# EAGLE design permacam (EAGLE 9.5.1)
AUTHOR: NEAL JACKSON; REV: A; TITLE: PERMAMOTE

## Sheet 1 of 4
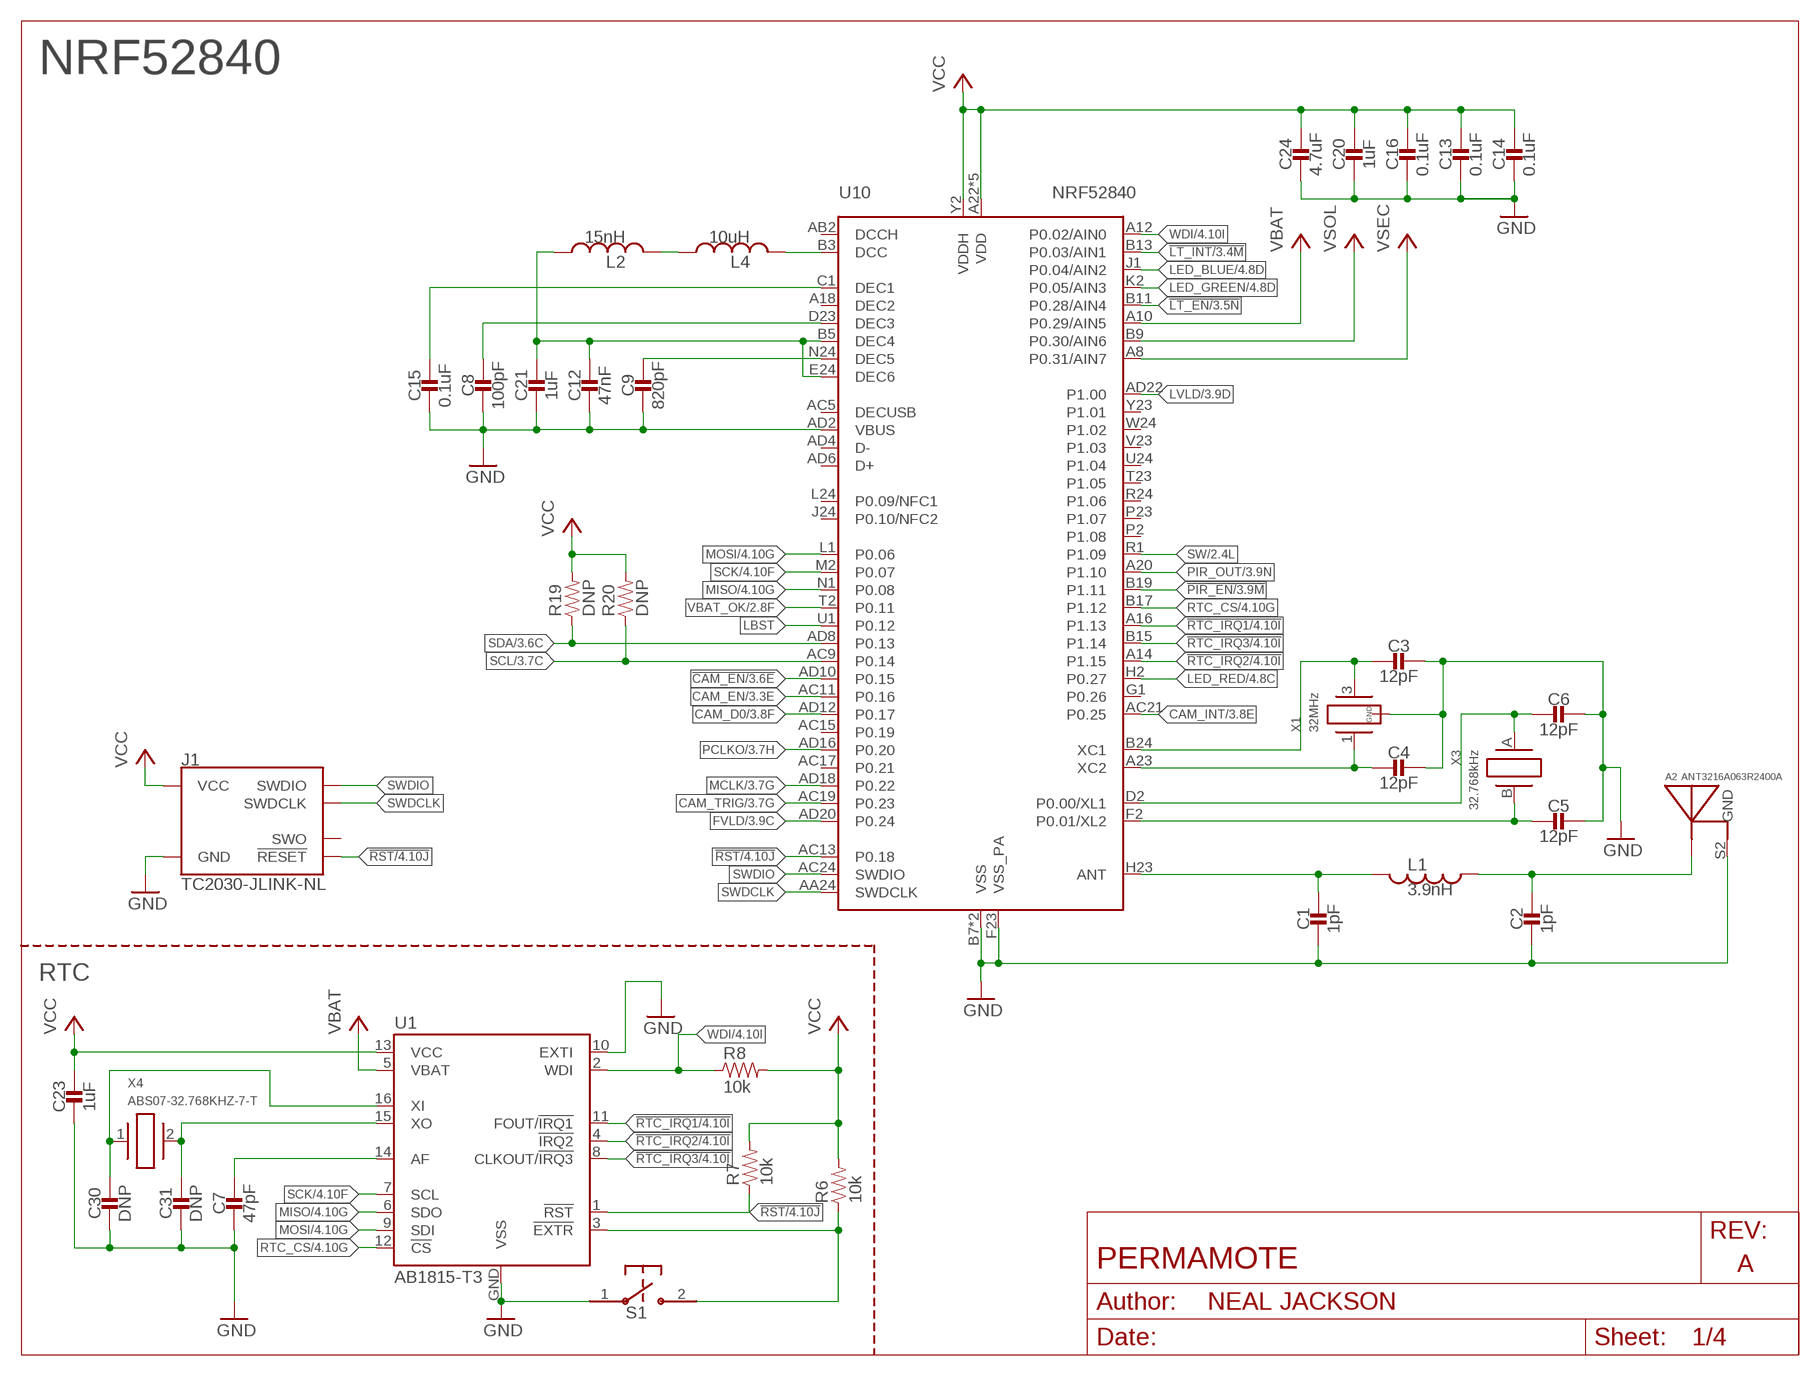
[diagram p0: schematic, sheet 1]

### Parts
A2  ANT3216A063R2400A  [ANT3216A063R2400A]
C1  1pF  CAPACITOR0402_CAP  [0402_CAP]
C2  1pF  CAPACITOR0402_CAP  [0402_CAP]
C3  12pF  CAPACITOR0402_CAP  [0402_CAP]
C4  12pF  CAPACITOR0402_CAP  [0402_CAP]
C5  12pF  CAPACITOR0402_CAP  [0402_CAP]
C6  12pF  CAPACITOR0402_CAP  [0402_CAP]
C7  47pF  CAPACITOR0402_CAP  [0402_CAP]
C8  100pF  CAPACITOR0402_CAP  [0402_CAP]
C9  820pF  CAPACITOR0402_CAP  [0402_CAP]
C12  47nF  CAPACITOR0402_CAP  [0402_CAP]
C13  0.1uF  CAPACITOR0402_CAP  [0402_CAP]
C14  0.1uF  CAPACITOR0402_CAP  [0402_CAP]
C15  0.1uF  CAPACITOR0402_CAP  [0402_CAP]
C16  0.1uF  CAPACITOR0402_CAP  [0402_CAP]
C20  1uF  CAPACITOR0402_CAP  [0402_CAP]
C21  1uF  CAPACITOR0402_CAP  [0402_CAP]
C23  1uF  CAPACITOR0402_CAP  [0402_CAP]
C24  4.7uF  CAPACITOR0402_CAP  [0402_CAP]
C30  DNP  CAPACITOR0402_CAP  [0402_CAP]
C31  DNP  CAPACITOR0402_CAP  [0402_CAP]
J1  TC2030-JLINK-NL  [TC2030-IDC-NL]
L1  3.9nH  INDUCTOR0402  [0402_CAP]
L2  15nH  INDUCTOR0402  [0402_CAP]
L4  10uH  INDUCTOR0603  [0603_CAP]
R6  10k  RESISTOR0402_RES  [0402_RES]
R7  10k  RESISTOR0402_RES  [0402_RES]
R8  10k  RESISTOR0402_RES  [0402_RES]
R19  DNP  RESISTOR0402_RES  [0402_RES]
R20  DNP  RESISTOR0402_RES  [0402_RES]
S1  B3U-1000P  [B3U-1000P]
U1  AB1815-T3  [QFN-16-3MM]
U10  NRF52840  [AQFN73]
X1  32MHz  7V-32.000MAHV-T  [TXC-7V]
X3  32.768kHz  ABS05-32.768KHZ-9-T  [ABS05]
X4  ABS07-32.768KHZ-7-T  [2-SMD]

### Nets
!CAM_EN: U10.AD10(P0.15) ; also sheet 3
!LT_EN: U10.B11(P0.28/AIN4) ; also sheet 3,4
!LT_INT: U10.B13(P0.03/AIN1) ; also sheet 3,4
!PIR_EN: U10.B19(P1.11) ; also sheet 3,4
!RST: J1.3(!RESET) R7.1 U1.1(!RST) U10.AC13(P0.18) ; also sheet 4
!RTC_EXTR: R6.1 S1.2 U1.3(!EXTR)
!RTC_IRQ1: U1.11(FOUT/!IRQ1) U10.A16(P1.13) ; also sheet 4
!RTC_IRQ2: U1.4(!IRQ2) U10.A14(P1.15) ; also sheet 4
!RTC_IRQ3: U1.8(CLKOUT/!IRQ3) U10.B15(P1.14) ; also sheet 4
CAM_D0: U10.AD12(P0.17) ; also sheet 3,4
CAM_EN: U10.AC11(P0.16) ; also sheet 3
CAM_INT: U10.AC21(P0.25) ; also sheet 3
CAM_TRIG: U10.AC19(P0.23) ; also sheet 3
FVLD: U10.AD20(P0.24) ; also sheet 3,4
GND: A2.S2(GND) C1.2 C2.2 C3.1 C4.1 C5.1 C6.1 C7.2 C8.2 C9.2 C12.2 C13.2 C14.2 C15.2 C16.2 C20.2 C21.2 C23.2 C24.2 C30.2 C31.2 J1.5(GND) S1.1 U1.10(EXTI) U1.GND(VSS) U10.AD2(VBUS) U10.B7(VSS) U10.F23(VSS_PA) U10.GND(VSS) X1.2(GND) X1.4(GND) ; also sheet 2,3,4
LBST: U10.U1(P0.12) ; also sheet 2
LED_BLUE: U10.J1(P0.04/AIN2) ; also sheet 4
LED_GREEN: U10.K2(P0.05/AIN3) ; also sheet 4
LED_RED: U10.H2(P0.27) ; also sheet 4
LVLD: U10.AD22(P1.00) ; also sheet 3,4
MCLK: U10.AD18(P0.22) ; also sheet 3,4
MISO: U1.6(SDO) U10.N1(P0.08) ; also sheet 4
MOSI: U1.9(SDI) U10.L1(P0.06) ; also sheet 4
N$1: C9.1 U10.N24(DEC5)
N$2: C15.1 U10.C1(DEC1)
N$3: C12.1 C21.1 L2.1 U10.B5(DEC4) U10.E24(DEC6)
N$4: C8.1 U10.D23(DEC3)
N$5: C1.1 L1.2 U10.H23(ANT)
N$6: A2.S1(ANTENNA) C2.1 L1.1
N$8: C3.2 U10.B24(XC1) X1.3
N$9: C4.2 U10.A23(XC2) X1.1
N$25: C7.1 U1.14(AF)
N$26: C30.1 U1.16(XI) X4.1
N$27: C31.1 U1.15(XO) X4.2
N$44: L4.2 U10.B3(DCC)
N$49: L2.2 L4.1
PCLKO: U10.AD16(P0.20) ; also sheet 3,4
PIR_OUT: U10.A20(P1.10) ; also sheet 3,4
RTC_CS: U1.12(!CS) U10.B17(P1.12) ; also sheet 4
SCK: U1.7(SCL) U10.M2(P0.07) ; also sheet 4
SCL: R20.1 U10.AC9(P0.14) ; also sheet 3,4
SDA: R19.1 U10.AD8(P0.13) ; also sheet 3,4
SW: U10.R1(P1.09) ; also sheet 2,4
SWDCLK: J1.4(SWDCLK) U10.AA24(SWDCLK)
SWDIO: J1.2(SWDIO) U10.AC24(SWDIO)
VBAT: U1.5(VBAT) U10.A10(P0.29/AIN5) ; also sheet 2
VBAT_OK: U10.T2(P0.11) ; also sheet 2
VCC: C13.1 C14.1 C16.1 C20.1 C23.1 C24.1 J1.1(VCC) R6.2 R7.2 R8.2 R19.2 R20.2 U1.13(VCC) U10.A22(VDD) U10.AD14(VDD) U10.AD23(VDD) U10.B1(VDD) U10.W1(VDD) U10.Y2(VDDH) ; also sheet 2,3,4
VSEC: U10.A8(P0.31/AIN7) ; also sheet 2
VSOL: U10.B9(P0.30/AIN6) ; also sheet 2,4
WDI: R8.1 U1.2(WDI) U10.A12(P0.02/AIN0) ; also sheet 4
XL1: C6.2 U10.D2(P0.00/XL1) X3.A
XL2: C5.2 U10.F2(P0.01/XL2) X3.B
Unconnected: J1.6(SWO) U10.A18(DEC2) U10.AB2(DCCH) U10.AC5(DECUSB) U10.AC15(P0.19) U10.AC17(P0.21) U10.AD4(D-) U10.AD6(D+) U10.G1(P0.26) U10.J24(P0.10/NFC2) U10.L24(P0.09/NFC1) U10.P2(P1.08) U10.P23(P1.07) U10.R24(P1.06) U10.T23(P1.05) U10.U24(P1.04) U10.V23(P1.03) U10.W24(P1.02) U10.Y23(P1.01)

### Notes on the sheet
- NRF52840
- RTC

## Sheet 2 of 4
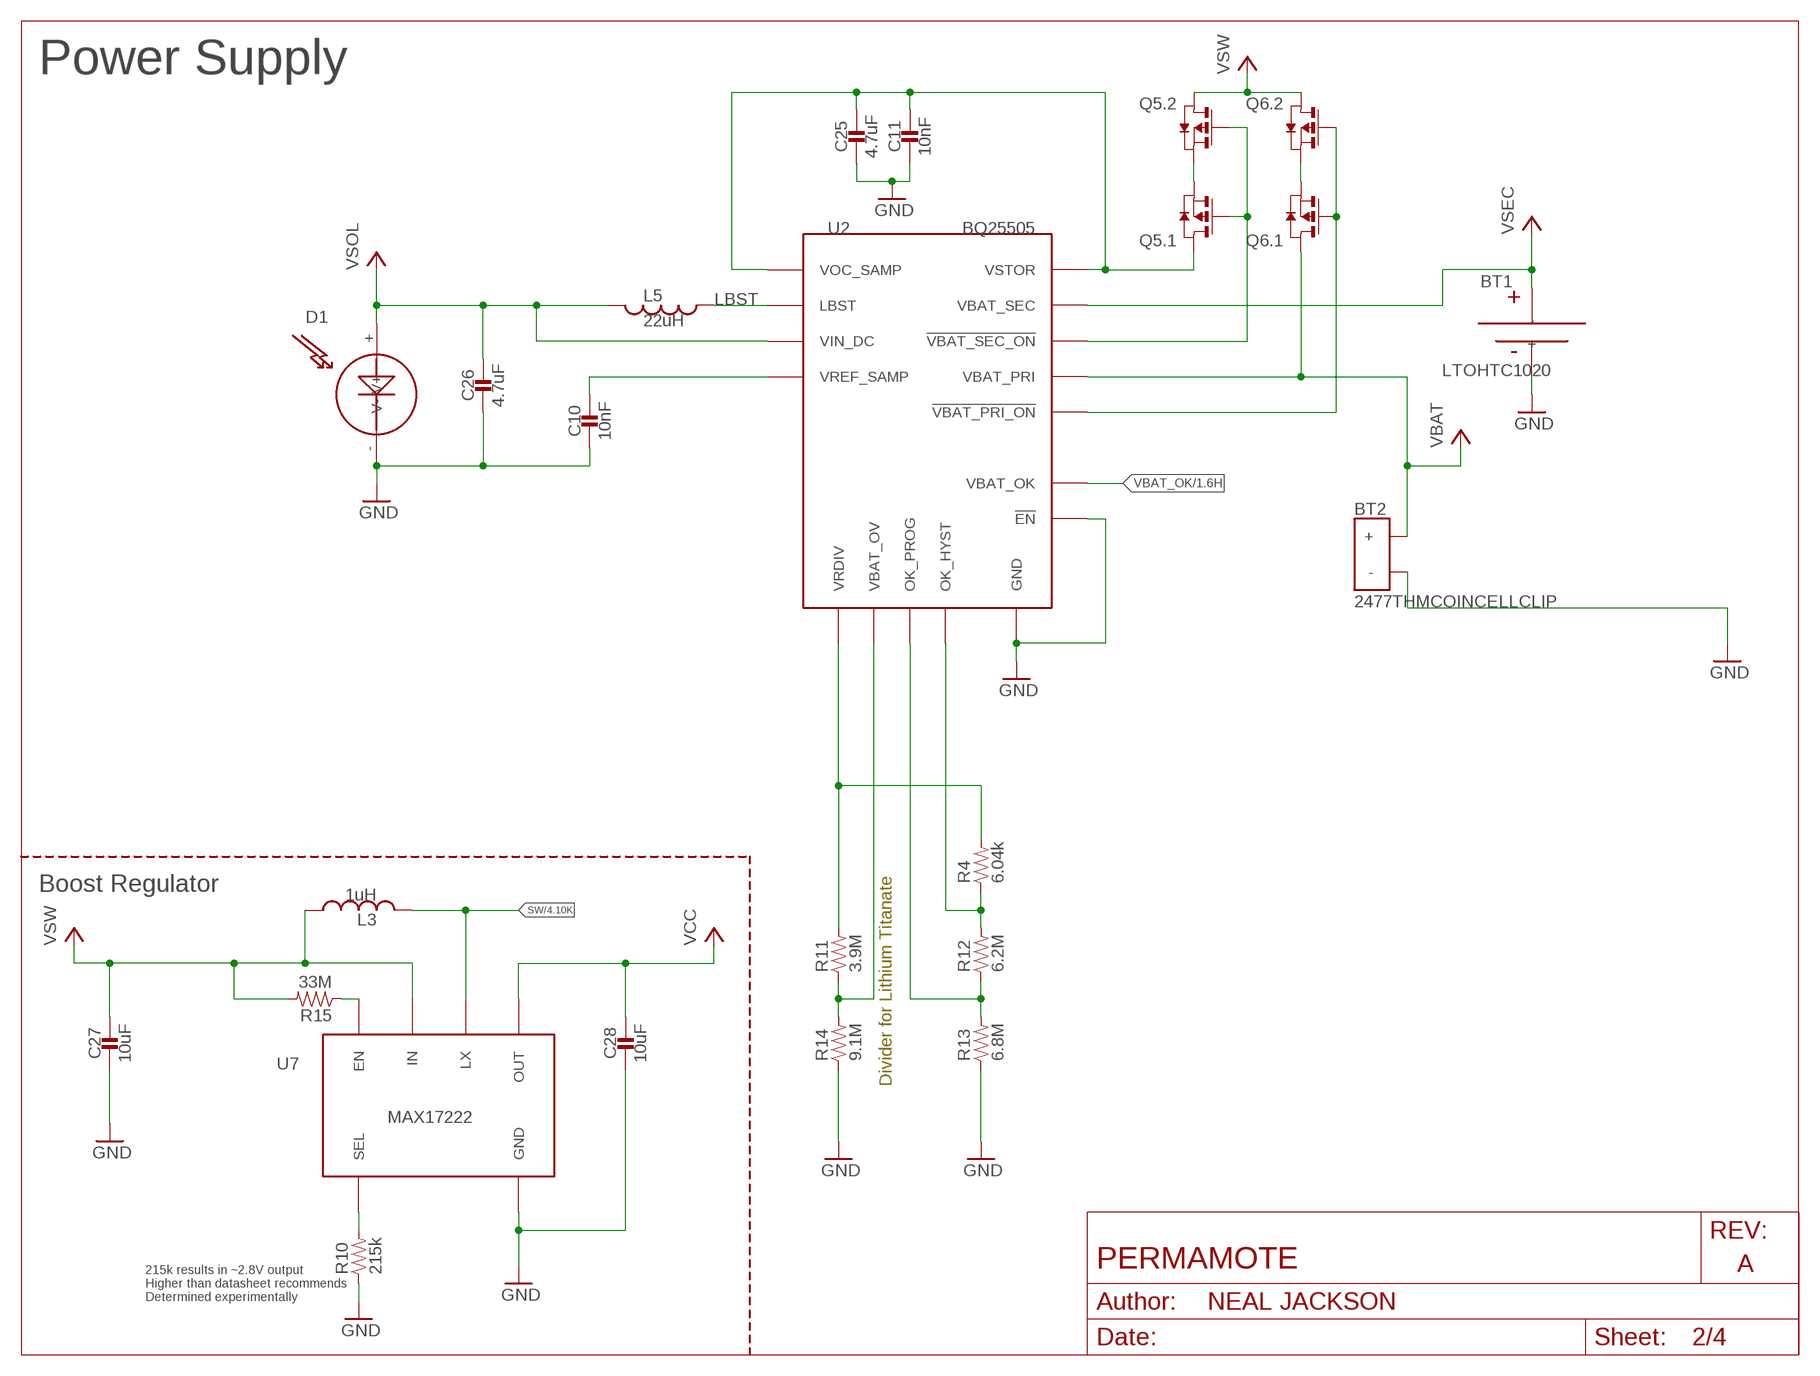
[diagram p1: schematic, sheet 2]

### Parts
BT1  LTOHTC1020  [1020]
BT2  2477THMCOINCELLCLIP  [2477THMCOINCLIP]
C10  10nF  CAPACITOR0402_CAP  [0402_CAP]
C11  10nF  CAPACITOR0402_CAP  [0402_CAP]
C25  4.7uF  CAPACITOR0402_CAP  [0402_CAP]
C26  4.7uF  CAPACITOR0402_CAP  [0402_CAP]
C27  10uF  CAPACITOR0603_CAP  [0603_CAP]
C28  10uF  CAPACITOR0603_CAP  [0603_CAP]
D1  SOLARCELLHOLES  [SOLAR_HOLES]
L3  1uH  INDUCTORIHL  [IHL-1212BZ-11]
L5  22uH  INDUCTOR74437324220  [74437324220]
Q5  PMDXB950UPEL  [XDFN-6]
Q6  PMDXB950UPEL  [XDFN-6]
R4  6.04k  RESISTOR0402_RES  [0402_RES]
R10  215k  RESISTOR0603_RES  [0603-RES]
R11  3.9M  RESISTOR0402_RES  [0402_RES]
R12  6.2M  RESISTOR0402_RES  [0402_RES]
R13  6.8M  RESISTOR0402_RES  [0402_RES]
R14  9.1M  RESISTOR0402_RES  [0402_RES]
R15  33M  RESISTOR0603_RES  [0603-RES]
U2  BQ25505  [S-PVQFN-N20-RGR]
U7  MAX17222  [UDFN-6-MAXIM]

### Nets
!VBAT_PRI_ON: Q6.2(.1:G) Q6.5(.2:G) U2.10(!VBAT_PRI_ON)
!VBAT_SEC_ON: Q5.2(.1:G) Q5.5(.2:G) U2.9(!VBAT_SEC_ON)
GND: BT1.- BT2.GND(-) C10.2 C11.2 C25.2 C26.2 C27.2 C28.2 D1.-(V-) R10.1 R13.1 R14.1 U2.1(GND) U2.5(!EN) U2.6(GND) U2.15(GND) U2.16(GND) U2.17(GND) U2.PAD(GND) U7.3(GND) ; also sheet 1,3,4
LBST: L5.P$1 U2.20(LBST) ; also sheet 1
N$12: R10.2 U7.4(SEL)
N$14: R15.1 U7.6(EN)
N$18: R11.1 R14.2 U2.7(VBAT_OV)
N$32: R4.2 R11.2 U2.8(VRDIV)
N$45: Q5.1(.1:S) Q5.4(.2:S)
N$53: Q6.1(.1:S) Q6.4(.2:S)
N$57: R12.1 R13.2 U2.12(OK_PROG)
N$58: R4.1 R12.2 U2.11(OK_HYST)
SW: L3.P$2 U7.2(LX) ; also sheet 1,4
VBAT: BT2.1(+) BT2.2(+) Q6.6(.1:D) U2.14(VBAT_PRI) ; also sheet 1
VBAT_OK: U2.13(VBAT_OK) ; also sheet 1
VCC: C28.1 U7.1(OUT) ; also sheet 1,3,4
VOC_SAMP_VSTOR: C11.1 C25.1 Q5.6(.1:D) U2.3(VOC_SAMP) U2.19(VSTOR)
VREF_SAMP: C10.1 U2.4(VREF_SAMP)
VSEC: BT1.+ U2.18(VBAT_SEC) ; also sheet 1
VSOL: C26.1 D1.+(V+) L5.P$2 U2.2(VIN_DC) ; also sheet 1,4
VSW: C27.1 L3.P$1 Q5.3(.2:D) Q6.3(.2:D) R15.2 U7.5(IN)

### Notes on the sheet
- Power Supply
- Boost Regulator
- Divider for Lithium Titanate
- 215k results in ~2.8V output
  Higher than datasheet recommends
  Determined experimentally

## Sheet 3 of 4
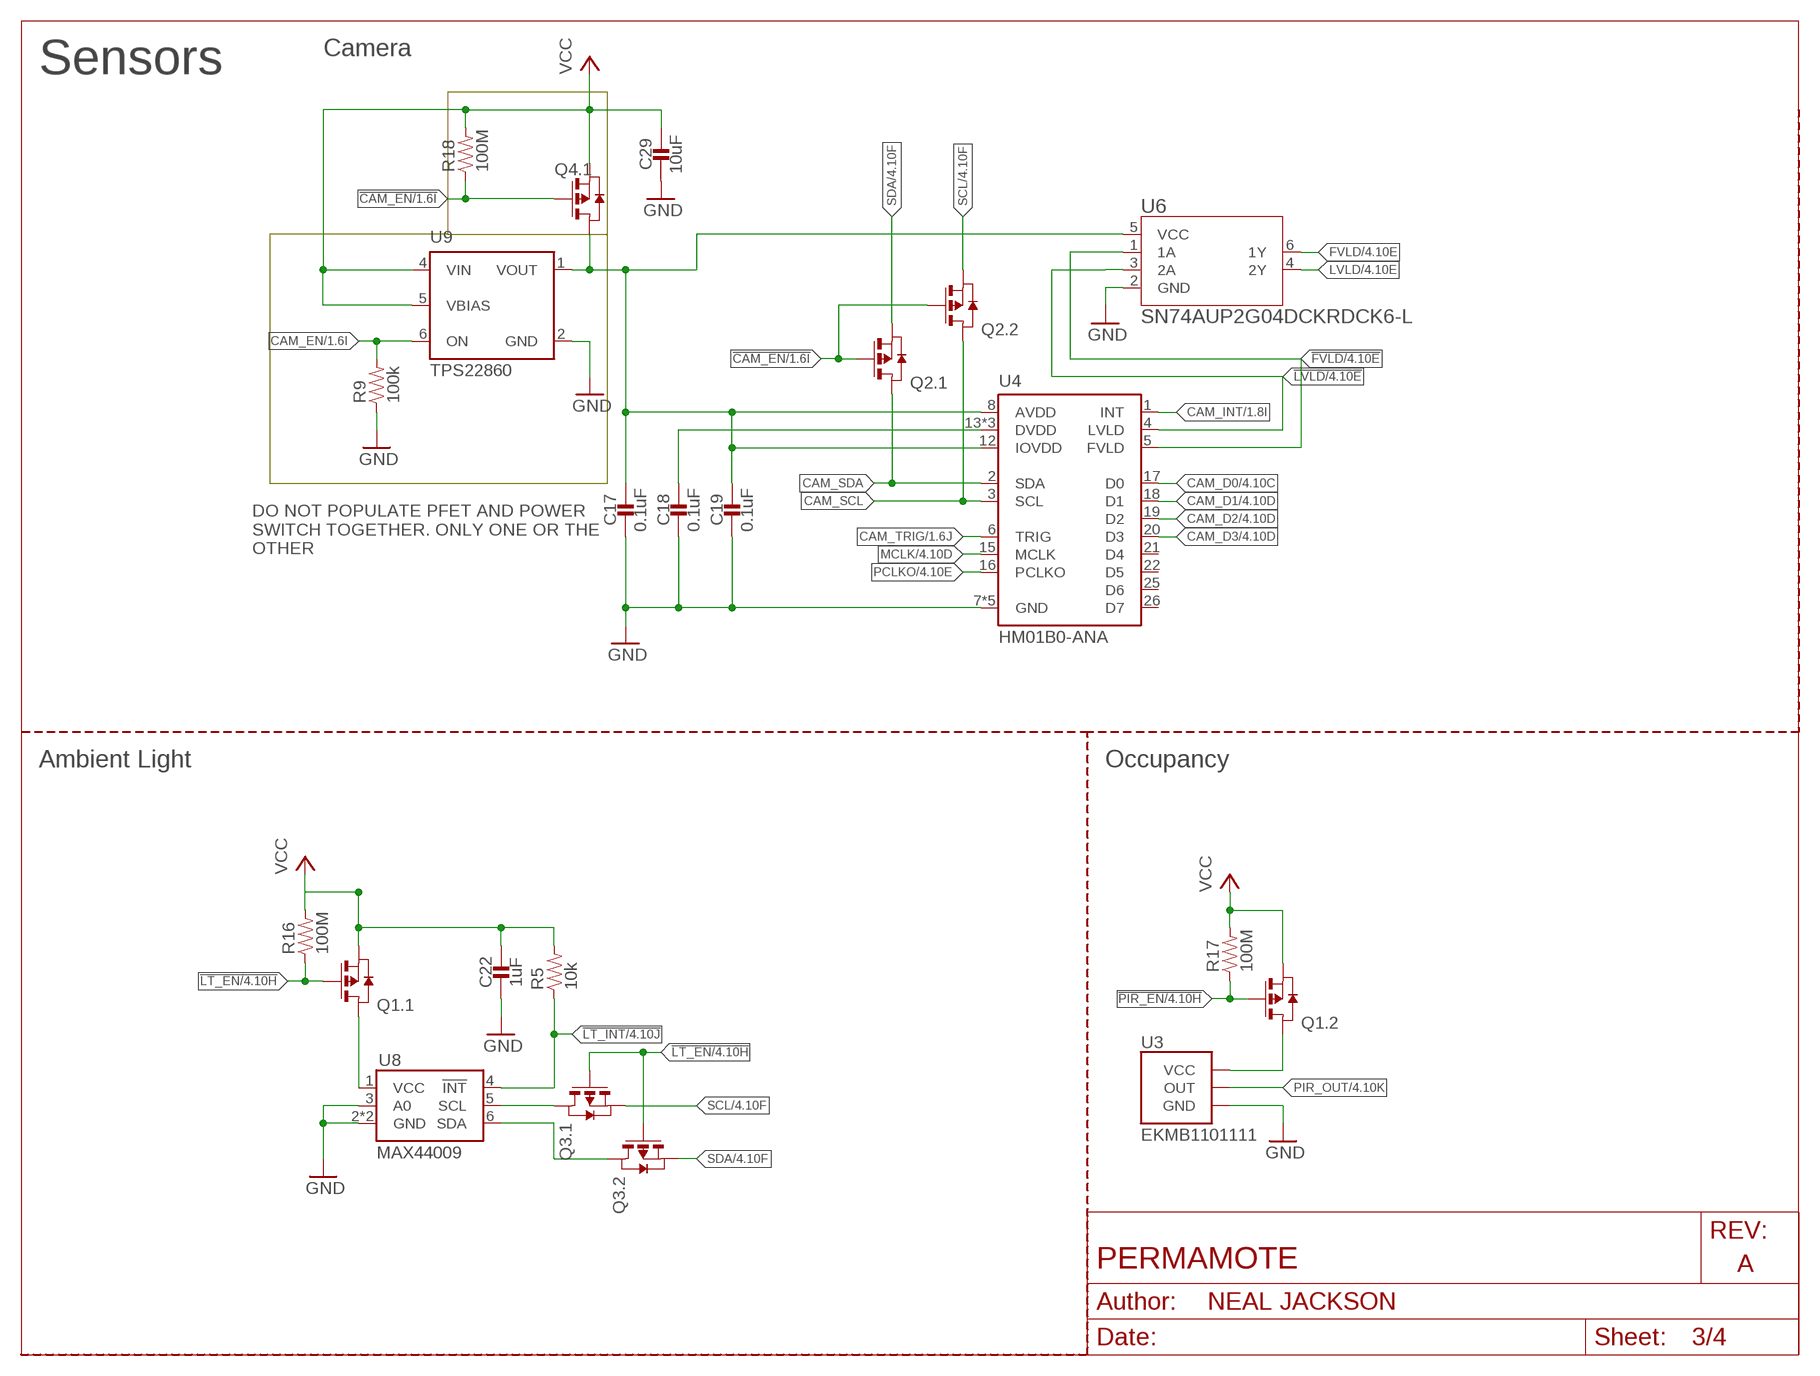
[diagram p2: schematic, sheet 3]

### Parts
C17  0.1uF  CAPACITOR0402_CAP  [0402_CAP]
C18  0.1uF  CAPACITOR0402_CAP  [0402_CAP]
C19  0.1uF  CAPACITOR0402_CAP  [0402_CAP]
C22  1uF  CAPACITOR0402_CAP  [0402_CAP]
C29  10uF  CAPACITOR0603_CAP  [0603_CAP]
Q1  PMDXB950UPEL  [XDFN-6]
Q2  PMDXB950UPEL  [XDFN-6]
Q3  PMDXB950UPEL  [XDFN-6]
Q4  PMDXB950UPEL  [XDFN-6]
R5  10k  RESISTOR0402_RES  [0402_RES]
R9  100k  RESISTOR0402_RES  [0402_RES]
R16  100M  RESISTOR0402_RES  [0402_RES]
R17  100M  RESISTOR0402_RES  [0402_RES]
R18  100M  RESISTOR0402_RES  [0402_RES]
U3  EKMB1101111  [AMN2]
U4  HM01B0-ANA  [NEOPAC-26]
U6  SN74AUP2G04DCKRDCK6-L  [DCK6-L]
U8  MAX44009  [UDFN-6-EXPOSED]
U9  TPS22860  [SOT-23-6]

### Nets
!CAM_EN: Q2.2(.1:G) Q2.5(.2:G) Q4.2(.1:G) R18.1 ; also sheet 1
!FVLD: U4.5(FVLD) U6.1(1A) ; also sheet 4
!LT_EN: Q1.2(.1:G) Q3.2(.1:G) Q3.5(.2:G) R16.1 ; also sheet 1,4
!LT_INT: R5.1 U8.4(!INT) ; also sheet 1,4
!LVLD: U4.4(LVLD) U6.3(2A) ; also sheet 4
!PIR_EN: Q1.5(.2:G) R17.1 ; also sheet 1,4
CAM_D0: U4.17(D0) ; also sheet 1,4
CAM_D1: U4.18(D1) ; also sheet 4
CAM_D2: U4.19(D2) ; also sheet 4
CAM_D3: U4.20(D3) ; also sheet 4
CAM_EN: R9.2 U9.6(ON) ; also sheet 1
CAM_INT: U4.1(INT) ; also sheet 1
CAM_SCL: Q2.3(.2:D) U4.3(SCL)
CAM_SDA: Q2.6(.1:D) U4.2(SDA)
CAM_TRIG: U4.6(TRIG) ; also sheet 1
FVLD: U6.6(1Y) ; also sheet 1,4
GND: C17.2 C18.2 C19.2 C22.2 C29.2 R9.1 U3.GND U4.7(GND) U4.9(GND) U4.10(GND) U4.11(GND) U4.24(GND) U6.2(GND) U8.2(GND) U8.3(A0) U8.EP(GND) U9.2(GND) ; also sheet 1,2,4
LVLD: U6.4(2Y) ; also sheet 1,4
MCLK: U4.15(MCLK) ; also sheet 1,4
N$10: C18.1 U4.13(DVDD) U4.14(DVDD) U4.23(DVDD)
N$13: C17.1 C19.1 Q4.6(.1:D) U4.8(AVDD) U4.12(IOVDD) U6.5(VCC) U9.1(VOUT)
N$20: Q1.6(.1:D) U8.1(VCC)
N$23: Q1.3(.2:D) U3.VCC
N$51: Q3.3(.2:D) U8.6(SDA)
N$52: Q3.6(.1:D) U8.5(SCL)
PCLKO: U4.16(PCLKO) ; also sheet 1,4
PIR_OUT: U3.OUT ; also sheet 1,4
SCL: Q2.4(.2:S) Q3.1(.1:S) ; also sheet 1,4
SDA: Q2.1(.1:S) Q3.4(.2:S) ; also sheet 1,4
VCC: C22.1 C29.1 Q1.1(.1:S) Q1.4(.2:S) Q4.1(.1:S) R5.2 R16.2 R17.2 R18.2 U9.4(VIN) U9.5(VBIAS) ; also sheet 1,2,4
Unconnected: Q4.3(.2:D) Q4.4(.2:S) Q4.5(.2:G) U4.21(D4) U4.22(D5) U4.25(D6) U4.26(D7)

### Notes on the sheet
- Camera
- Sensors
- DO NOT POPULATE PFET AND POWER
  SWITCH TOGETHER. ONLY ONE OR THE
  OTHER
- Ambient Light | Occupancy

## Sheet 4 of 4
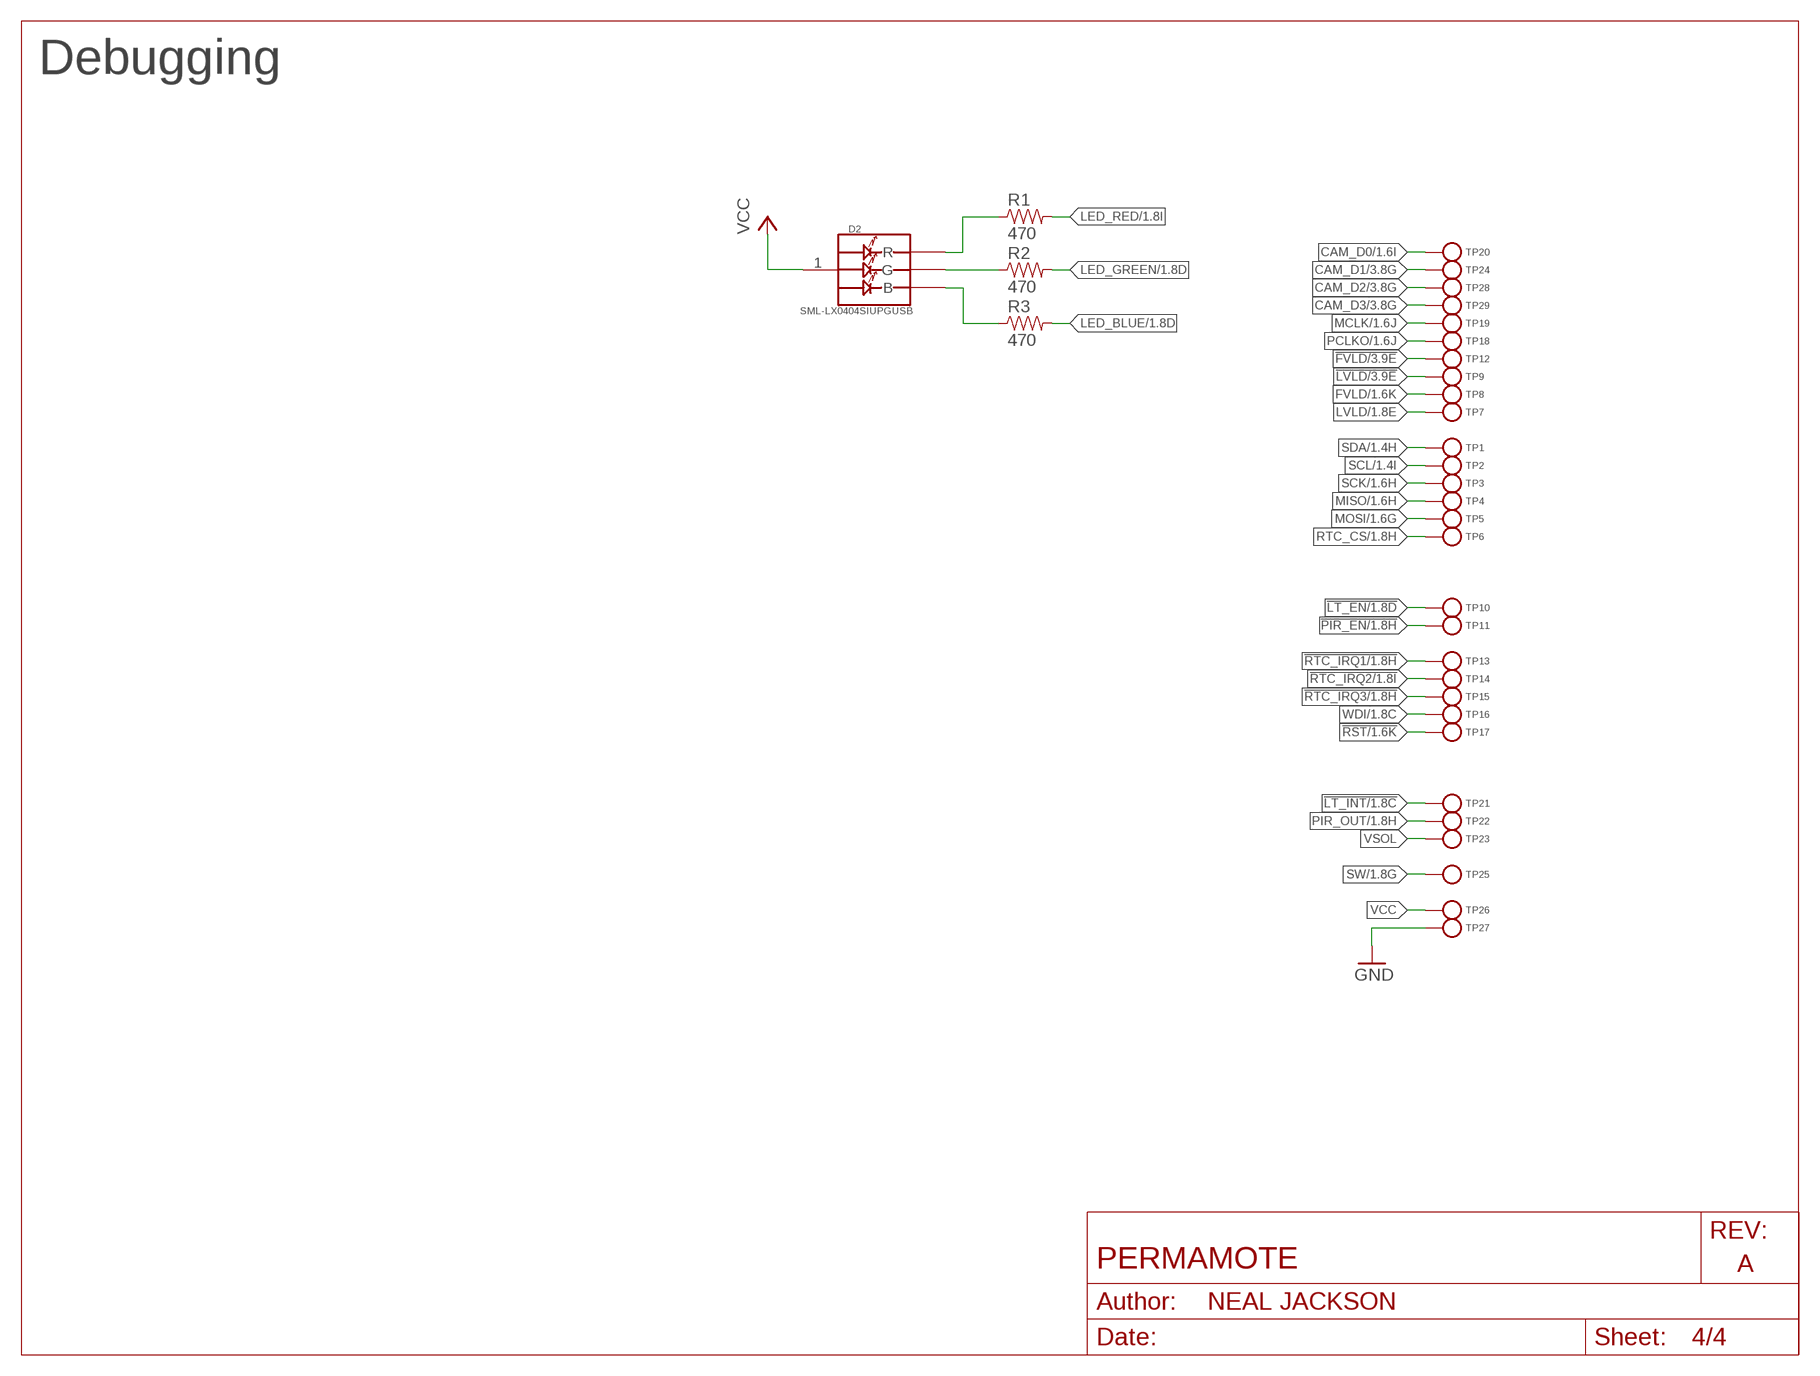
[diagram p3: schematic, sheet 4]

### Parts
D2  SML-LX0404SIUPGUSB  [1MM_SQ_4PAD]
R1  470  RESISTOR0402_RES  [0402_RES]
R2  470  RESISTOR0402_RES  [0402_RES]
R3  470  RESISTOR0402_RES  [0402_RES]
TP1  TEST-POINT  [PAD.03X.03]
TP2  TEST-POINT  [PAD.03X.03]
TP3  TEST-POINT  [PAD.03X.03]
TP4  TEST-POINT  [PAD.03X.03]
TP5  TEST-POINT  [PAD.03X.03]
TP6  TEST-POINT  [PAD.03X.03]
TP7  TEST-POINT  [PAD.03X.03]
TP8  TEST-POINT  [PAD.03X.03]
TP9  TEST-POINT  [PAD.03X.03]
TP10  TEST-POINT  [PAD.03X.03]
TP11  TEST-POINT  [PAD.03X.03]
TP12  TEST-POINT  [PAD.03X.03]
TP13  TEST-POINT  [PAD.03X.03]
TP14  TEST-POINT  [PAD.03X.03]
TP15  TEST-POINT  [PAD.03X.03]
TP16  TEST-POINT  [PAD.03X.03]
TP17  TEST-POINT  [PAD.03X.03]
TP18  TEST-POINT  [PAD.03X.03]
TP19  TEST-POINT  [PAD.03X.03]
TP20  TEST-POINT  [PAD.03X.03]
TP21  TEST-POINT  [PAD.03X.03]
TP22  TEST-POINT  [PAD.03X.03]
TP23  TEST-POINT  [PAD.03X.03]
TP24  TEST-POINT  [PAD.03X.03]
TP25  TEST-POINT  [PAD.03X.03]
TP26  TEST-POINT  [PAD.03X.03]
TP27  TEST-POINT  [PAD.03X.03]
TP28  TEST-POINT  [PAD.03X.03]
TP29  TEST-POINT  [PAD.03X.03]

### Nets
!FVLD: TP12.P$1(TESTPOINT) ; also sheet 3
!LT_EN: TP10.P$1(TESTPOINT) ; also sheet 1,3
!LT_INT: TP21.P$1(TESTPOINT) ; also sheet 1,3
!LVLD: TP9.P$1(TESTPOINT) ; also sheet 3
!PIR_EN: TP11.P$1(TESTPOINT) ; also sheet 1,3
!RST: TP17.P$1(TESTPOINT) ; also sheet 1
!RTC_IRQ1: TP13.P$1(TESTPOINT) ; also sheet 1
!RTC_IRQ2: TP14.P$1(TESTPOINT) ; also sheet 1
!RTC_IRQ3: TP15.P$1(TESTPOINT) ; also sheet 1
CAM_D0: TP20.P$1(TESTPOINT) ; also sheet 1,3
CAM_D1: TP24.P$1(TESTPOINT) ; also sheet 3
CAM_D2: TP28.P$1(TESTPOINT) ; also sheet 3
CAM_D3: TP29.P$1(TESTPOINT) ; also sheet 3
FVLD: TP8.P$1(TESTPOINT) ; also sheet 1,3
GND: TP27.P$1(TESTPOINT) ; also sheet 1,2,3
LED_BLUE: R3.2 ; also sheet 1
LED_GREEN: R2.2 ; also sheet 1
LED_RED: R1.2 ; also sheet 1
LVLD: TP7.P$1(TESTPOINT) ; also sheet 1,3
MCLK: TP19.P$1(TESTPOINT) ; also sheet 1,3
MISO: TP4.P$1(TESTPOINT) ; also sheet 1
MOSI: TP5.P$1(TESTPOINT) ; also sheet 1
N$15: D2.2(R) R1.1
N$17: D2.4(G) R2.1
N$19: D2.3(B) R3.1
PCLKO: TP18.P$1(TESTPOINT) ; also sheet 1,3
PIR_OUT: TP22.P$1(TESTPOINT) ; also sheet 1,3
RTC_CS: TP6.P$1(TESTPOINT) ; also sheet 1
SCK: TP3.P$1(TESTPOINT) ; also sheet 1
SCL: TP2.P$1(TESTPOINT) ; also sheet 1,3
SDA: TP1.P$1(TESTPOINT) ; also sheet 1,3
SW: TP25.P$1(TESTPOINT) ; also sheet 1,2
VCC: D2.1(VDD) TP26.P$1(TESTPOINT) ; also sheet 1,2,3
VSOL: TP23.P$1(TESTPOINT) ; also sheet 1,2
WDI: TP16.P$1(TESTPOINT) ; also sheet 1

### Notes on the sheet
- Debugging

## Library data of the parts
A2 = chips:ANT3216A063R2400A: Yageo 2.4GHz WiFi/Bluetooth/Zigbee/ISM Chip Antenna; DIGIKEY: 311-1542-1-ND; MANUFACTURER: YAGEO; MPN: ANT3216A063R2400A
BT1 = batteries:LTOHTC
BT2 = batteries:2477THMCOINCELLCLIP: Battery clip for 2477 Coin Cell; DIGIKEY: 36-3039-ND; MANUFACTURER: Keystone; MPN: 3039
C1 C2 = passives:CAPACITOR: SMD Capacitor; DIGIKEY: 1276-1595-1-ND; MPN: CL05C010CB5NNNC
C3-C6 = passives:CAPACITOR: SMD Capacitor; DIGIKEY: 490-6197-1-ND; MPN: GRM1555C1H120GA01D
C7 = passives:CAPACITOR: SMD Capacitor; DIGIKEY: 490-5942-1-ND; MPN: GRM1555C1H470JA01D
C8 = passives:CAPACITOR: SMD Capacitor; DIGIKEY: 490-5922-1-ND; MPN: GRM1555C1H101JA01D
C9 = passives:CAPACITOR: SMD Capacitor; DIGIKEY: 1276-6535-1-ND; MPN: CL05B821KO5NNNC
C10 C11 = passives:CAPACITOR: SMD Capacitor; DIGIKEY: 490-4516-1-ND; MPN: GRM155R71H103KA88D
C12 = passives:CAPACITOR: SMD Capacitor; DIGIKEY: 445-1264-1-ND; MPN: C1005X7R1C473K050BC
C13-C19 = passives:CAPACITOR: SMD Capacitor; DIGIKEY: 490-6328-1-ND; MPN: GRM155R71C104KA88J
C20-C23 = passives:CAPACITOR: SMD Capacitor; DIGIKEY: 490-7195-1-ND; MPN: GRM155R70G105KA12D
C24-C26 = passives:CAPACITOR: SMD Capacitor; DIGIKEY: 445-5947-1-ND; MPN: C1005X5R0J475K050BC
C27-C29 = passives:CAPACITOR: SMD Capacitor; DIGIKEY: 490-3896-1-ND; MPN: GRM188R60J106ME47D
C30 C31 = passives:CAPACITOR: SMD Capacitor
D1 = permamote:SOLARCELL: Generic solar cell; DIGIKEY: 869-1001-ND; MPN: AM-1454CA
D2 = leds:SML-LX0404SIUPGUSB: 1mm^2 RGB LED; DIGIKEY: 67-2125-1-ND; MANUFACTURER: Lumex Opto; MPN: SML-LX0404SIUPGUSB
J1 = connector:TC2030-JLINK
L1 = passives:INDUCTOR: A very specific inductor; DIGIKEY: 490-1131-1-ND; MPN: LQP15MN3N9B02D
L2 = passives:INDUCTOR: A very specific inductor; DIGIKEY: 587-1521-1-ND; MPN: HK100515NJ-T
L3 = passives:INDUCTOR: A very specific inductor; DIGIKEY: 541-1319-1-ND; MANUFACTURER: Vishay Dale; MPN: IHLP1212BZER1R0M11
L4 = passives:INDUCTOR: A very specific inductor; DIGIKEY: 490-4025-1-ND; MPN: LQM18FN100M00D
L5 = passives:INDUCTOR: A very specific inductor; DIGIKEY: 732-3340-1-ND; MPN: 74437324220
Q1-Q6 = fets:PMDXB950UPEL: 20 V 500mA, dual P-channel Trench MOSFET; DIGIKEY: 1727-2601-1-ND; MANUFACTURER: NEXPERIA; MPN: PMDXB950UPELZ
R1-R3 = passives:RESISTOR: Resistor Basic schematic elements and footprints for 0201, 0402, 0603, 1206, and PTH resistors.; DIGIKEY: 311-470JRCT-ND; MPN: RC0402JR-07470RL
R4 = passives:RESISTOR: Resistor Basic schematic elements and footprints for 0201, 0402, 0603, 1206, and PTH resistors.; DIGIKEY: YAG2293CT-ND; MPN: RC0402FR-076K04L
R5-R8 = passives:RESISTOR: Resistor Basic schematic elements and footprints for 0201, 0402, 0603, 1206, and PTH resistors.; DIGIKEY: 311-10KJRCT-ND; MPN: RC0402JR-0710KL
R9 = passives:RESISTOR: Resistor Basic schematic elements and footprints for 0201, 0402, 0603, 1206, and PTH resistors.; DIGIKEY: 311-100KJRCT-ND; MPN: RC0402JR-07100KL
R10 = passives:RESISTOR: Resistor Basic schematic elements and footprints for 0201, 0402, 0603, 1206, and PTH resistors.; DIGIKEY: 311-215KHRCT-ND; MPN: RC0603FR-07215KL
R11 = passives:RESISTOR: Resistor Basic schematic elements and footprints for 0201, 0402, 0603, 1206, and PTH resistors.; DIGIKEY: YAG3301CT-ND; MPN: RC0402JR-073M9L
R12 = passives:RESISTOR: Resistor Basic schematic elements and footprints for 0201, 0402, 0603, 1206, and PTH resistors.; DIGIKEY: YAG3309CT-ND; MPN: RC0402JR-076M2L
R13 = passives:RESISTOR: Resistor Basic schematic elements and footprints for 0201, 0402, 0603, 1206, and PTH resistors.; DIGIKEY: YAG3310CT-ND; MPN: RC0402JR-076M8L
R14 = passives:RESISTOR: Resistor Basic schematic elements and footprints for 0201, 0402, 0603, 1206, and PTH resistors.; DIGIKEY: YAG3322CT-ND; MPN: RC0402JR-079M1L
R15 = passives:RESISTOR: Resistor Basic schematic elements and footprints for 0201, 0402, 0603, 1206, and PTH resistors.; DIGIKEY: HMC0603JT33M0CT-ND; MPN: HMC0603JT33M0
R16-R18 = passives:RESISTOR: Resistor Basic schematic elements and footprints for 0201, 0402, 0603, 1206, and PTH resistors.; DIGIKEY: 541-100MAHCT-ND; MPN: HMC0402JT100M
R19 R20 = passives:RESISTOR: Resistor Basic schematic elements and footprints for 0201, 0402, 0603, 1206, and PTH resistors.
S1 = switches:B3U: Switch; DIGIKEY: SW1020CT-ND; MANUFACTURER: Omron; MPN: B3U-1000P
TP1-TP29 = headers:TEST-POINT
U1 = chips:AB1815-T3: Ultra-low current RTC. 55nA quiescent @ 3V. 1.5-3.6V input.; DIGIKEY: 535-11936-1-ND; MANUFACTURER: Abracon; MPN: AB1815-T3
U2 = chips:BQ25505: EH front end for switching between primary and secondary cells; DIGIKEY: 296-37078-1-ND; MANUFACTURER: TI; MPN: BQ25505RGRR
U3 = chips:EKMB: Passive infrared human detection sensor with built-in amp.; DIGIKEY: 255-3065-ND; MANUFACTURER: PANASONIC; MPN: EKMB1101111
U4 = chips:HM01B0: ultra low power CMOS Image Sensor 320 x 320; MPN: HMB01B0-ANA
U6 = chips:SN74AUP2G04DCKR; MANUFACTURER_PART_NUMBER: SN74AUP2G04DCKR; VENDOR: Texas Instruments
U7 = chips:MAX17222: Very high efficiency, very low power boost converter suitable for EH applications; DIGIKEY: MAX17222ELT+TCT-ND; MANUFACTURER: MAXIM INTEGRATED; MPN: MAX17222ELT+T
U8 = chips:MAX44009: low power ambient light sensor; DIGIKEY: MAX44009EDT+TCT-ND; MANUFACTURER: MAXIM; MPN: MAX44009EDT+T
U9 = chips:TPS22860: Ultra-Low Leakage Load Switch; DIGIKEY: 296-43982-1-ND; MPN: TPS22860DBVR
U10 = chips:NRF52840: ultra-low power 2.4 GHz wireless system on chip (SoC) integrating a multiprotocol 2.4 GHz transceiver, an ARM® Cortex®-M4F CPU.; DIGIKEY: 1490-1071-1-ND; MANUFACTURER: NORIDIC SEMICONDUCTOR; MPN: NRF52840
X1 = crystals:7V: TXC CRYSTAL SMD; DIGIKEY: 887-2568-1-ND; MANUFACTURER: TXC CORPORATION; MPN: 7M-32.000MAHV-T
X3 = crystals:ABS05-32.768KHZ: 32.768kHz Crystal; DIGIKEY: 535-11897-1-ND; MANUFACTURER: Abracon; MPN: ABS05-32.768KHZ-9-T
X4 = crystals:ABS07-32.768KHZ: 32.768kHz Crystal; DIGIKEY: 535-9543-1-ND; MANUFACTURER: ABRACON; MPN: ABS07-32.768KHZ-7-T

## Board
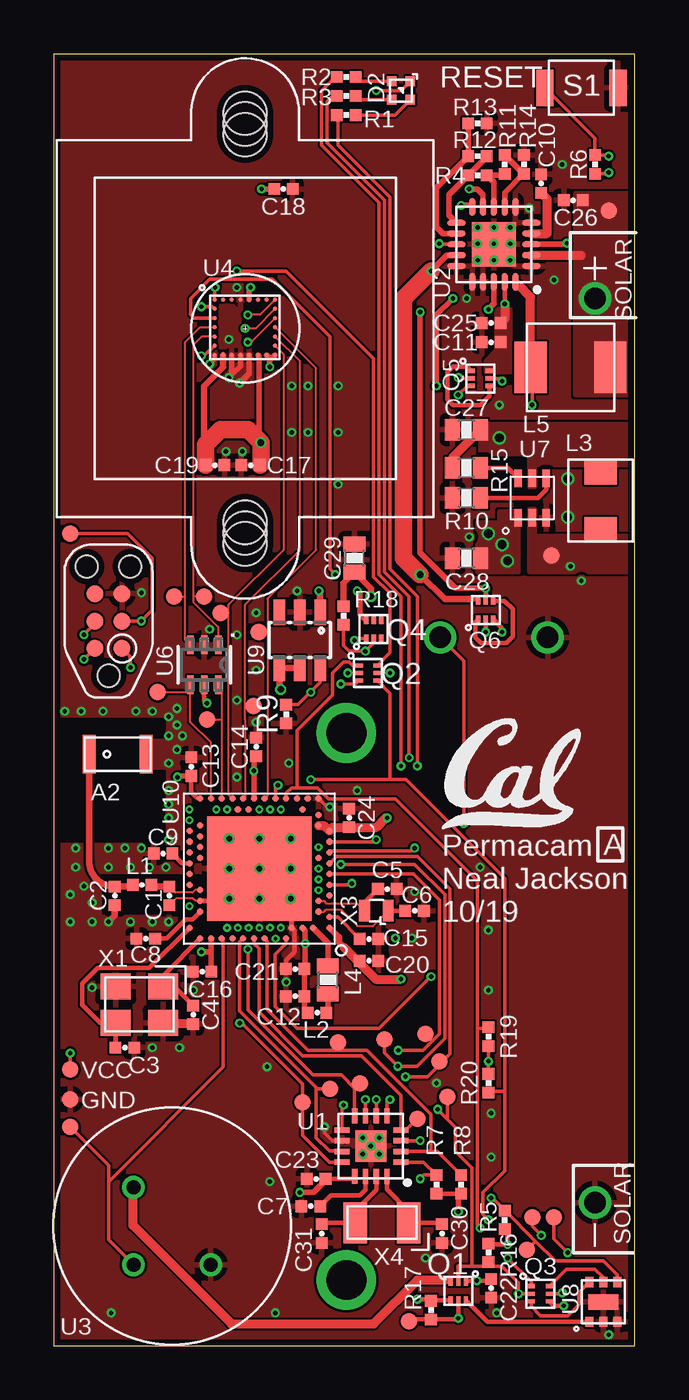
[diagram p4: board, top side]
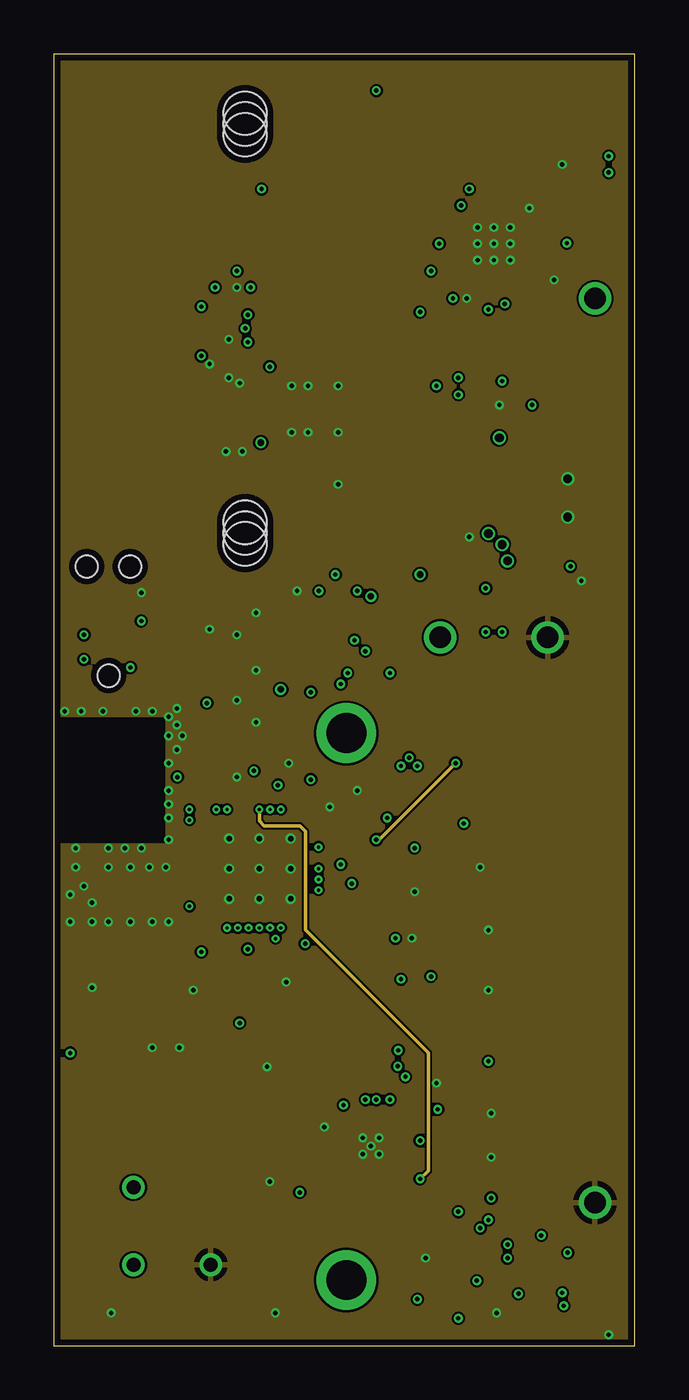
[diagram p5: board, inner layer Route2]
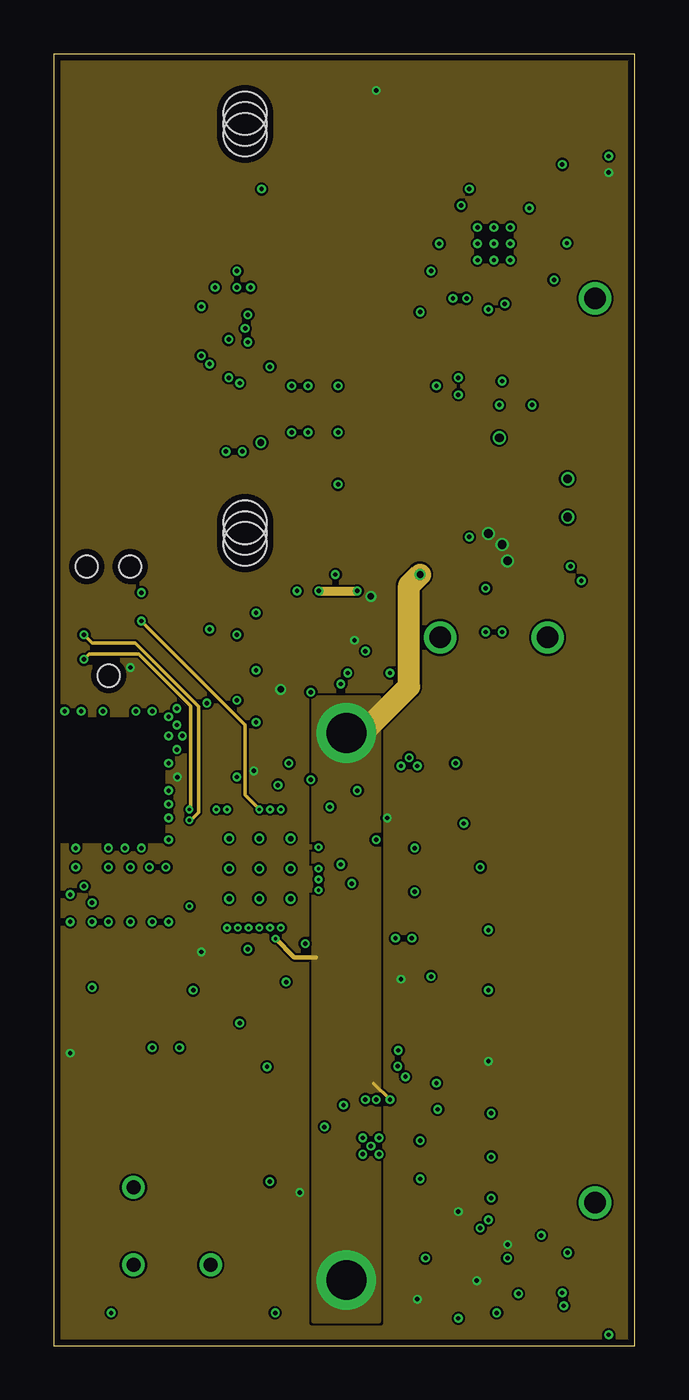
[diagram p6: board, inner layer Route15]
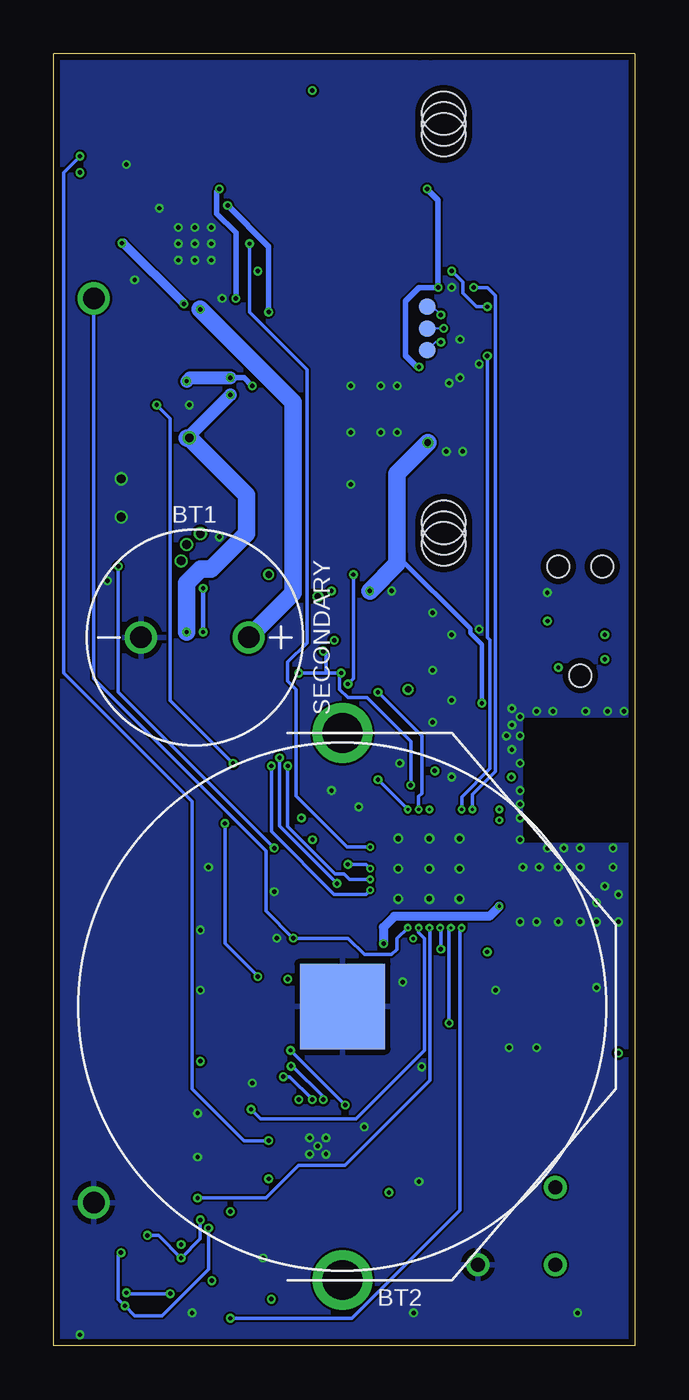
[diagram p7: board, bottom side, seen from below]

Size 27 x 60 mm. Coordinates in mm from the lower left corner, seen from the top.
Outline: 9.5,60 27,60 27,0 0,0 0,60 10,60
Copper layers (1+2*15+16): Top 0.0178mm / dielectric 59mil / Route2 0.0356mm / dielectric 0.1499mm / Route15 0.0356mm / dielectric 0.2007mm / Bottom 0.0178mm
Design rules "quickturn_co_kr_1oz_4lyr *": minimum track width 4mil, minimum drill 8mil, track to track 4mil, track to pad 4mil, pad to pad 4mil, via to via 4mil, smd to smd 4mil, copper to edge 12mil, drill to drill 12mil, minimum pad ring 8mil, minimum via ring 4mil, stop-mask expansion 3mil, vias tented up to drill 50mil, thermal gap 10mil
tRestrict: area 25.8,0.9 to 25.9,1.4

### Footprints (pad centres in the part's own frame; a part is rotated, then mirrored left to right if it is on the bottom)
ANT3216A063R2400A = smd 0.6 x 1.8: S1 -1.325,0; S2 1.325,0
1020 = drill 1: + -2.5,0; - 2.5,0
2477THMCOINCLIP = drill 1.854: 1 -12.7,0; 2 12.7,0 | smd 3.962 x 3.962: GND 0,0
0402_CAP = smd 0.536 x 0.546: 1 -0.433,0; 2 0.433,0
0603_CAP = smd 0.7 x 1: 1 -0.65,0; 2 0.65,0
SOLAR_HOLES = drill 1: + 0,0; - 42,0
1MM_SQ_4PAD = smd 0.457 x 0.457: 1 0.432,0.432; 2 0.432,-0.432; 3 -0.432,-0.432; 4 -0.432,0.432
TC2030-IDC-NL = smd 0.787 x 0.787: 1 -1.27,-0.635; 2 -1.27,0.635; 3 0,-0.635; 4 0,0.635; 5 1.27,-0.635; 6 1.27,0.635 | hole 1.016: -2.54,0; 2.54,1.016; 2.54,-1.016
IHL-1212BZ-11 = smd 1.2 x 1.5: P$1 -1.35,0; P$2 1.35,0
74437324220 = smd 1.5 x 2.4: P$1 1.85,0; P$2 -1.85,0
XDFN-6 = smd 0.35 x 0.2: 1 -0.425,0.35; 2 -0.425,0; 3 -0.425,-0.35; 4 0.425,-0.35; 5 0.425,0; 6 0.425,0.35
0402_RES = smd 0.536 x 0.546: 1 -0.433,0; 2 0.433,0
0603-RES = smd 0.7 x 1: 1 -0.65,0; 2 0.65,0
B3U-1000P = smd 0.8 x 1.7: 1 -1.7,0; 2 1.7,0
PAD.03X.03 = smd 0.762 x 0.762: P$1 0,0
QFN-16-3MM = smd 0.7 x 0.25: 1 -1.4,0.75; 2 -1.4,0.25; 3 -1.4,-0.25; 4 -1.4,-0.75; 9 1.35,-0.75; 10 1.35,-0.25; 11 1.35,0.25; 12 1.35,0.75 | smd 0.25 x 0.7: 5 -0.75,-1.4; 6 -0.25,-1.4; 7 0.25,-1.4; 8 0.75,-1.4; 13 0.75,1.4; 14 0.25,1.4; 15 -0.25,1.4; 16 -0.75,1.4 | smd 1.45 x 1.45: GND 0,0
S-PVQFN-N20-RGR = smd 0.28 x 0.85: 1 -1,-1.74; 2 -0.5,-1.74; 3 0,-1.74; 4 0.5,-1.74; 5 1,-1.74; 11 1,1.74; 12 0.5,1.74; 13 0,1.74; 14 -0.5,1.74; 15 -1,1.74 | smd 0.85 x 0.28: 6 1.74,-1; 7 1.74,-0.5; 8 1.74,0; 9 1.74,0.5; 10 1.74,1; 16 -1.74,1; 17 -1.74,0.5; 18 -1.74,0; 19 -1.74,-0.5; 20 -1.74,-1 | smd 2.05 x 2.05: PAD 0,0
AMN2 = drill 0.65: GND 1.796,-1.796; OUT -1.796,-1.796; VCC -1.796,1.796
NEOPAC-26 = smd 0.22 x 0.22: 1 -1.427,1.346; 2 -1.427,0.916; 3 -1.427,0.487; 4 -1.427,0.058; 5 -1.427,-0.371; 6 -1.427,-0.8; 7 -1.427,-1.23; 8 -1.024,-1.23; 9 -0.62,-1.23; 10 -0.217,-1.23; 11 0.187,-1.23; 12 0.591,-1.23; 13 0.994,-1.23; 14 1.398,-1.23; 15 1.398,-0.8; 16 1.398,-0.371; 17 1.398,0.058; 18 1.398,0.487; 19 1.398,0.916; 20 1.398,1.346; 21 0.994,1.346; 22 0.591,1.346; 23 0.187,1.346; 24 -0.217,1.346; 25 -0.62,1.346; 26 -1.024,1.346 | hole 2: 0,10; 0,-10; 0,9; 0,-9; 0,-9.5; 0,9.5
DCK6-L = smd 0.864 x 0.305: 1 -0.927,0.65; 2 -0.927,0; 3 -0.927,-0.65; 4 0.927,-0.65; 5 0.927,0; 6 0.927,0.65
UDFN-6-MAXIM = smd 0.8 x 0.35: 1 -0.915,0.65; 2 -0.915,0; 3 -0.915,-0.65; 4 0.915,-0.65; 5 0.915,0; 6 0.915,0.65
UDFN-6-EXPOSED = smd 0.48 x 0.36: 1 -0.925,0.65; 2 -0.925,0; 3 -0.925,-0.65; 4 0.925,-0.65; 5 0.925,0; 6 0.925,0.65 | smd 0.71 x 1.4: EP 0,0
SOT-23-6 = smd 0.55 x 1.2: 1 -0.95,-1.3; 2 0,-1.3; 3 0.95,-1.3; 4 0.95,1.3; 5 0,1.3; 6 -0.95,1.3
AQFN73 = smd 0.3 x 0.3: A8 -1.25,3.25; A10 -0.75,3.25; A12 -0.25,3.25; A14 0.25,3.25; A16 0.75,3.25; A18 1.25,3.25; A20 1.75,3.25; A22 2.25,3.25; A23 2.75,3.25; AA24 3.25,-2.25; AB2 -2.75,-2.5; AC5 -2,-2.75; AC9 -1,-2.75; AC11 -0.5,-2.75; AC13 0,-2.75; AC15 0.5,-2.75; AC17 1,-2.75; AC19 1.5,-2.75; AC21 2,-2.75; AC24 3.25,-2.75; AD2 -2.75,-3.25; AD4 -2.25,-3.25; AD6 -1.75,-3.25; AD8 -1.25,-3.25; AD10 -0.75,-3.25; AD12 -0.25,-3.25; AD14 0.25,-3.25; AD16 0.75,-3.25; AD18 1.25,-3.25; AD20 1.75,-3.25; AD22 2.25,-3.25; AD23 2.75,-3.25; B1 -3.25,2.75; B3 -2.5,2.75; B5 -2,2.75; B7 -1.5,2.75; B9 -1,2.75; B11 -0.5,2.75; B13 0,2.75; B15 0.5,2.75; B17 1,2.75; B19 1.5,2.75; B24 3.25,2.75; C1 -3.25,2.25; D2 -2.75,2; D23 2.75,2; E24 3.25,1.75; F2 -2.75,1.5; F23 2.75,1.5; G1 -3.25,1.25; H2 -2.75,1; H23 2.75,1; J1 -3.25,0.75; J24 3.25,0.75; K2 -2.75,0.5; L1 -3.25,0.25; L24 3.25,0.25; M2 -2.75,0; N1 -3.25,-0.25; N24 3.25,-0.25; P2 -2.75,-0.5; P23 2.75,-0.5; R1 -3.25,-0.75; R24 3.25,-0.75; T2 -2.75,-1; T23 2.75,-1; U1 -3.25,-1.25; U24 3.25,-1.25; V23 2.75,-1.5; W1 -3.25,-1.75; W24 3.25,-1.75; Y2 -2.75,-2; Y23 2.75,-2 | smd 4.85 x 4.85: GND 0,0
TXC-7V = smd 1.4 x 1.2: 1 -1.1,-0.85; 2 1.1,-0.85; 3 1.1,0.85; 4 -1.1,0.85
ABS05 = smd 0.5 x 1: A -0.55,0; B 0.55,0
2-SMD = smd 1.092 x 1.905: 1 -1.245,0; 2 1.245,0

### Placement (x,y rotation side)
A2  2.97,27.47 0 top
BT1  20.45,32.89 180 bottom
BT2  13.59,15.75 90 bottom
C1  5.37,20.89 270 top
C2  2.83,20.89 270 top
C3  3.3,13.84 180 top
C4  6.48,15.37 90 top
C5  15.49,21.21 180 top
C6  16.76,20.19 180 top
C7  11.94,6.48 180 top
C8  4.28,18.91 180 top
C9  5.08,22.86 180 top
C10  22.64,53.98 90 top
C11  20.32,46.61 180 top
C12  11.21,16.22 180 top
C13  6.39,26.89 90 top
C14  9.4,27.81 90 top
C15  14.64,18.89 0 top
C16  6.9,17.37 180 top
C17  9.14,40.89 180 top
C18  10.67,53.72 0 top
C19  7.49,40.89 0 top
C20  14.64,17.88 0 top
C21  11.21,17.49 180 top
C22  20.32,2.67 270 top
C23  12.19,7.75 180 top
C24  13.72,24.51 90 top
C25  20.32,47.5 180 top
C26  24.13,53.2 180 top
C27  19.18,42.55 180 top
C28  19.18,36.58 180 top
C29  13.97,36.58 90 top
C30  18.03,5.21 270 top
C31  12.45,5.21 270 top
D1  25.15,48.64 270 top
D2  16.13,58.29 0 top
J1  2.54,33.66 90 top
L1  4.1,21.4 0 top
L2  12.23,15.46 0 top
L3  25.4,39.24 270 top
L4  12.74,16.99 90 top
L5  24,45.43 180 top
Q1  18.8,2.54 270 top
Q2  14.61,31.24 0 top
Q3  22.61,2.41 0 top
Q4  14.86,33.27 90 top
Q5  19.81,44.93 0 top
Q6  20.07,34.16 90 top
R1  13.59,57.15 180 top
R2  13.59,58.93 180 top
R3  13.59,58.04 180 top
R4  19.68,54.36 0 top
R5  20.95,5.84 270 top
R6  25.15,54.86 270 top
R7  17.78,7.49 270 top
R8  18.92,7.49 270 top
R9  10.79,29.34 90 top
R10  19.18,39.37 0 top
R11  20.95,54.86 270 top
R12  19.68,55.24 0 top
R13  19.68,56.77 180 top
R14  21.84,54.86 270 top
R15  19.18,40.77 180 top
R16  20.19,4.32 90 top
R17  17.53,1.65 90 top
R18  13.46,33.91 90 top
R19  20.19,14.35 270 top
R20  20.19,12.19 90 top
S1  24.51,58.42 180 top
TP1  23.24,5.97 0 top
TP2  22.23,5.97 0 top
TP3  15.37,14.22 180 top
TP4  17.91,13.21 0 top
TP5  17.27,14.48 0 top
TP6  11.56,11.3 0 top
TP7  4.83,30.35 0 top
TP8  7.11,29.08 0 top
TP9  5.59,34.8 0 top
TP10  18.29,11.56 0 top
TP11  16.51,1.14 0 top
TP12  6.99,34.8 0 top
TP13  12.83,11.94 180 top
TP14  16.89,10.54 180 top
TP15  14.22,12.19 0 top
TP16  13.21,14.1 0 top
TP17  0.76,37.72 0 top
TP18  9.27,29.72 0 top
TP19  7.75,34.04 0 top
TP20  9.53,33.15 0 top
TP21  21.97,4.45 0 top
TP22  0.76,10.16 0 top
TP23  25.78,52.7 0 top
TP24  9.65,46.23 180 bottom
TP25  23.11,36.7 0 top
TP26  0.76,12.83 0 top
TP27  0.76,11.43 0 top
TP28  9.65,47.24 0 bottom
TP29  9.65,48.26 0 bottom
U1  14.73,9.27 180 top
U2  20.45,51.15 90 top
U3  5.5,5.56 0 top
U4  8.89,47.24 0 top
U6  6.99,31.62 270 top
U7  22.23,39.37 90 top
U8  25.53,2.03 90 top
U9  11.43,32.77 180 top
U10  9.55,22.16 180 top
U$2  [UCB_CAL_200MIL]  18.03,24 0 top
X1  3.98,15.84 180 top
X3  14.99,20.19 180 top
X4  15.24,5.71 180 top

### Tracks (layer width: path | path; a pad name or v marks a point on that pad's centre or on a via)
!CAM_EN  (via drill 0.2)
  Top 0.102: Q2.2 v13.65,31.24 | v15.62,31.24 Q2.5
  Top 0.152: R18.1 13.46,32.51 13.72,32.26 v14.48,32.26 14.86,32.64 Q4.2 | v10.41,26.04 10.3,25.92 U10.AD10
  Bottom 0.152: 14.35,31.24 v15.62,31.24 | v14.48,32.26 14.35,32.13 14.35,31.24 | v10.41,26.04 10.41,28.07 12.45,30.1 13.34,30.1 13.72,30.48 13.72,31.18 v13.65,31.24 14.35,31.24
!FVLD
  Top 0.102: U6.1 7.63,33.39 6.48,34.54 6.48,34.8 | U4.5 6.86,46.86 6.48,46.48 6.48,34.8 | TP12.P$1 6.48,34.8
!LT_EN  (via drill 0.15, 0.2)
  Top 0.152: Q3.5 23.58,2.41 v23.62,2.46 | Q3.2 v21.59,2.41 21.59,2.92 20.83,3.68 20.19,3.68 | 18.8,3.68 19.43,3.68 | 19.43,3.68 20.19,3.68 | 19.43,3.68 19.43,8.26 18.67,9.02 18.67,10.14 18.29,10.52 | 18.29,10.52 TP10.P$1 | R16.1 20.19,3.68 | v17.83,10.97 18.29,10.52
  Top 0.203: 18.8,3.68 Q1.2
  Bottom 0.152: v23.62,2.46 23.62,2.41 v21.59,2.41 | U10.B11 10.05,19.19 9.78,18.92 9.78,13.72 12.95,10.54 17.4,10.54 v17.83,10.97
  other vias: 10.05,19.41
!LT_INT  (via drill 0.15, 0.2)
  Top 0.152: U8.4 26.18,3.29 25.53,3.94 23.29,3.94 22.38,4.85 | 22.38,4.85 R5.1 20.37,6.86 v20.32,6.86 | TP21.P$1 22.38,4.85
  Bottom 0.152: v20.32,6.86 17.14,6.86 15.62,8.38 13.46,8.38 9.53,12.32 9.53,19.38 U10.B13
  other vias: 9.55,19.41
!LVLD
  Top 0.102: U6.3 6.1,32.79 6.1,34.8 | U4.4 6.79,47.3 6.1,46.61 6.1,34.8 | TP9.P$1 6.1,34.8
!PIR_EN  (via drill 0.15, 0.2)
  Top 0.152: U10.B19 | U10.B19
  Top 0.203: Q1.5 v18.8,1.27 18.74,1.22 R17.1 16.59,1.22 TP11.P$1
  Bottom 0.152: U10.B19 8.13,19.33 8.13,6.29 13.15,1.27 v18.8,1.27
  other vias: 8.05,19.41
!RST  (via drill 0.15, 0.2)
  Top 0.152: U1.1 17.18,8.52 R7.1 17.2,7.93 v17.02,7.75 | J1.3 v4.06,33.66 4.57,34.16 4.57,36.58 3.43,37.72 TP17.P$1
  Route2 0.152: v17.02,7.75 17.4,8.13 17.4,13.59 11.68,19.3 11.68,23.88 11.43,24.13 9.78,24.13 9.55,24.36 U10.AC13
  Route15 0.152: v4.06,33.66 8.89,28.83 8.89,25.57 U10.AC13
  other vias: 9.55,24.91
!RTC_EXTR  (via drill 0.2)
  Top 0.152: U1.3 v17.01,9.52 v17.02,9.53 | S1.2 25.15,56.09 R6.1 25.73,55.3 v25.78,55.24
  Bottom 0.152: v17.02,9.53 18.16,9.53 20.57,11.94 20.57,25.27 26.54,31.24 26.54,54.48 v25.78,55.24
!RTC_IRQ1
  Top 0.152: U1.11 13.36,9.04 12.81,9.04 12.19,9.66 12.19,12 | U10.A16 8.64,18.74 8.64,15.56 12.19,12 | 12.19,12 12.26,11.94 TP13.P$1
!RTC_IRQ2
  Top 0.152: U10.A14 9.3,18.67 9.53,18.45 9.53,15.49 11.56,13.46 14.3,13.46 16.13,11.63 U1.4 16.37,10.02 TP14.P$1
!RTC_IRQ3  (via drill 0.15, 0.2)
  Top 0.152: v9.02,18.41 9.02,15.59 12.03,12.57 13.36,12.57 13.98,11.95 | U1.8 13.98,11.95 | 13.98,11.95 TP15.P$1
  Bottom 0.152: U10.B15 9.02,19.37 v9.02,18.41
  other vias: 9.05,19.41
!VBAT_PRI_ON  (via drill 0.2)
  Top 0.203: Q6.2 v20.07,33.15 | Q6.5 v20.07,35.18
  Top 0.254: v18.92,52.96 19.38,52.96 U2.10 | v20.07,35.18 18.67,35.18 17.02,36.83 v17.02,48.01
  Bottom 0.203: v20.07,35.18 v20.07,33.15
  Bottom 0.254: v17.02,48.01 17.02,51.05 v18.92,52.96
!VBAT_SEC_ON  (via drill 0.2)
  Top 0.152: Q5.2 18.83,44.93 v18.8,44.96 | Q5.5 20.7,44.93 v20.83,44.8
  Top 0.254: v19.3,53.72 19.68,53.72 19.95,53.46 U2.9 | v18.54,48.64 17.78,47.88 v17.78,44.58
  Bottom 0.254: v19.3,53.72 19.43,53.59 19.43,52.58 18.54,51.69 v18.54,48.64 | v17.78,44.58 18.16,44.96 v18.8,44.96
  Bottom 0.61: v20.83,44.8 20.67,44.96 v18.8,44.96
CAM_D0
  Top 0.102: U10.AD12 9.93,25.53 9.93,33.15 | 9.93,33.15 9.93,34.69 12.19,36.96 12.19,45.4 U4.17 | TP20.P$1 9.93,33.15
CAM_D1  (via drill 0.2)
  Top 0.102: U4.18 9.16,46.61 v9.02,46.61
  Bottom 0.102: v9.02,46.61 9.27,46.61 TP24.P$1
CAM_D2  (via drill 0.2)
  Top 0.102: U4.19 9.37,47.24 v8.89,47.24
  Bottom 0.102: v8.89,47.24 TP28.P$1
CAM_D3  (via drill 0.2)
  Top 0.102: U4.20 9.58,47.88 v9.02,47.88
  Bottom 0.102: v9.02,47.88 9.4,48.26 TP29.P$1
CAM_EN  (via drill 0.15, 0.2)
  Top 0.152: U9.6 12.38,30.8 v11.94,30.35 11.36,29.77 R9.2
  Bottom 0.152: U10.AC11 10.05,25.51 9.91,25.65 9.91,28.32 v11.94,30.35
  other vias: 10.05,24.91
CAM_INT  (via drill 0.15, 0.2)
  Top 0.152: U4.1 7.46,49.12 v7.49,49.15
  Bottom 0.152: U10.AC21 7.55,25.6 6.48,26.67 6.48,48.77 6.86,49.15 v7.49,49.15
  other vias: 7.55,24.91
CAM_SCL  (via drill 0.2)
  Top 0.152: Q2.3 14.02,30.73 v13.34,30.73 | U4.3 6.5,47.73 6.35,47.88 6.35,48.64 7.24,49.53 10.16,49.53 12.83,46.86 12.83,36.07 v13.08,35.81
  Bottom 0.152: v13.34,30.73 13.08,30.99 v13.08,35.81
CAM_SDA  (via drill 0.2)
  Top 0.152: v6.86,48.26 7.36,48.26 U4.2 | v8.51,49.91 10.79,49.91 14.86,45.85 14.86,35.71 15.62,34.95 15.62,32.18 Q2.6
  Bottom 0.152: v6.86,48.26 7.37,48.26 8,48.9 8,49.4 v8.51,49.91
CAM_TRIG  (via drill 0.15, 0.2)
  Top 0.152: U4.6 6.99,45.97 v6.86,45.97
  Bottom 0.152: v6.86,45.97 6.86,32.89 6.73,32.77 6.73,26.8 8.05,25.48 U10.AC19
  other vias: 8.05,24.91
FVLD
  Top 0.102: U6.6 7.8,30.53 7.8,29.08 | 7.8,29.08 U10.AD20 | TP8.P$1 7.8,29.08
GND  (via drill 0.2, 0.25, 0.41)
  Top 0.102: U10.F23 6.58,20.66 6.46,20.78 5.69,20.78 C1.2
  Top 0.152: U10.AD2 12.69,25.02 v12.83,25.02 | 7.62,20.65 7.73,20.76 v8.15,20.76 | 8.04,20.65 U10.GND 8.05,20.66 7.49,20.66 | v12.57,10.16 12.57,9.89 12.94,9.52 U1.10
  Top 0.203: U10.GND 11.05,20.66 U10.B7 11.18,19.28 11.18,18.29 10.78,17.89 C21.2 | U10.F23 7.49,20.66 | 7.62,20.65 8.04,20.65 v8.15,20.76 | U4.7 7.46,45.82 v7.24,45.59
  Top 0.254: U4.9 8.27,45.1 | 8.27,45.1 v8.13,44.96 | U4.10 8.67,45.5 8.27,45.1 | U4.11 9.08,45.15 v8.64,44.7
  Top 0.305: v2.54,19.68 2.83,19.97 C2.2
  Top 0.406: C4.1 5.13,14.93 X1.4
  other vias: 19.18,48.64 23.88,40.26 23.88,38.48 19.68,51.94 20.45,51.94 21.21,51.94 21.21,51.18 20.45,51.18 19.68,51.18 19.68,50.42 20.45,50.42 21.21,50.42 23.24,49.5 8.15,22.16 9.55,22.16 11,22.16 9.55,20.76 9.55,23.56 11,23.56 8.15,23.56 11,20.76 1.78,16.64 14.73,9.27 15.11,8.89 14.35,8.89 14.35,9.65 15.11,9.65 20.7,43.69 5.33,19.68 4.57,19.68 3.56,19.68 1.78,19.68 3.3,23.11 4.45,22.23 5.21,22.23 5.33,24.51 5.33,25.78 5.33,27.05 5.33,28.32 2.54,23.11 1.02,23.11 1.78,20.57 1.4,21.34 1.02,22.23 2.54,22.23 3.56,22.23 0.76,19.68 0.76,20.95 5.71,28.83 5.71,27.69 10.29,1.52 2.67,1.52 16.64,18.92 16.76,21.08 22.1,52.83 23.62,54.86 4.57,13.84 5.84,13.84 6.48,16.51 10.03,7.62 17.27,4.06 9.91,12.95 17.78,12.19 19.3,37.56 24.51,35.53 4.07,34.97 5.33,23.5 4.06,23.11 8.51,49.15 5.33,25.15 5.33,29.21 4.57,29.46 3.81,29.46 2.29,29.46 1.27,29.46 0.51,29.46 25.78,0.51 8.13,46.74 20.57,1.52 10.79,16.89 8,41.53 8.76,41.53 8.51,33.02 5.97,28.32 5.71,29.59 7.24,33.27 19.81,22.23 14.1,25.78 13.21,44.58 13.21,42.42 13.21,40.01 9.4,31.37 11.05,44.58 11.05,42.42 11.81,44.58 11.81,42.42 9.4,34.04 8.51,29.97 8.51,26.42 9.4,28.96 20.32,10.79 20.32,8.76 20.19,16.51 20.19,19.3 10.92,27.05 11.3,35.05
  pour Top (rank 2): 0,60 27,60 27,0 0,0
  pour Bottom (rank 2): 0,60 27,60 27,0 0,0
  pour Top (rank 2, no thermals): 4.11,26.71 4.11,28.23 5.4,28.23 5.4,26.7
  pour Route2 (rank 2): 0,60 0,0 27,0 27,60
LBST  (via drill 0.2)
  Top 0.152: L5.P$1 22.23,45.36 v22.23,43.69 | U10.U1 14.89,23.41 v14.98,23.5
  Top 0.203: 21.59,49.27 U2.20
  Top 0.406: L5.P$1 22.15,48.7 21.59,49.27
  Route2 0.152: v14.98,23.5 15.12,23.5 v18.67,27.05
  Bottom 0.152: v18.67,27.05 21.59,29.97 21.59,43.05 v22.23,43.69
LED_BLUE  (via drill 0.2)
  Top 0.152: U10.J1 13.79,21.41 v13.84,21.46 | v16.51,27.3 16.51,34.8 15.37,35.94 15.37,53.21 12.7,55.88 12.7,57.78 12.95,58.04 R3.2
  Bottom 0.152: v13.84,21.46 16.51,24.13 v16.51,27.3
LED_GREEN  (via drill 0.15, 0.2)
  Top 0.152: v16.13,26.92 16.13,34.8 15.11,35.81 15.11,53.09 12.45,55.75 12.45,58.29 13.08,58.93 R2.2
  Bottom 0.152: U10.K2 13.27,21.66 13.53,21.91 13.93,21.91 16.13,24.11 v16.13,26.92
  other vias: 12.3,21.66
LED_RED  (via drill 0.15, 0.2)
  Top 0.152: v16.89,26.92 16.89,34.8 15.62,36.07 15.62,53.34 13.21,55.75 13.21,57.1 R1.2
  Bottom 0.152: v16.89,26.92 16.89,23.88 13.97,20.95 12.5,20.95 U10.H2
  other vias: 12.3,21.16
LVLD
  Top 0.102: U10.AD22 7.3,28.01 6.33,28.97 6.33,30.35 | 6.33,30.35 U6.4 | TP7.P$1 6.33,30.35
MCLK
  Top 0.102: U10.AD18 8.13,25.58 8.13,34.04 | 8.13,34.04 8.13,34.42 10.67,36.96 10.67,46.06 U4.15 | TP19.P$1 8.13,34.04
MISO  (via drill 0.2)
  Top 0.152: U1.6 v14.98,11.43 v14.99,11.43 | TP4.P$1 18.07,13.21 | 18.07,13.21 18.41,13.55 18.41,21.21 16.89,22.73 13.13,22.73 U10.N1 | v16.34,12.49 17.36,12.49 18.07,13.21
  Bottom 0.152: v14.99,11.43 16.05,12.49 v16.34,12.49
MOSI  (via drill 0.2)
  Top 0.152: U1.9 13.38,11.1 v13.46,11.18 | 17.59,14.16 17.91,14.48 17.91,20.7 16.7,21.91 U10.L1 | TP5.P$1 17.59,14.16 | v16,13.72 17.14,13.72 17.59,14.16
  Bottom 0.152: v16,13.72 v13.46,11.18
N$1
  Top 0.203: U10.N24 5.97,22.41 C9.1
N$2
  Top 0.152: C15.1 13.2,19.91 U10.C1
N$3  (via drill 0.15, 0.2)
  Top 0.254: L2.1 11.65,15.61 C12.1 C21.1 11.68,17.52 v11.68,18.67 11.68,19.28 U10.B5
  Bottom 0.406: U10.E24 6.77,19.94 11.18,19.94 11.68,19.43 v11.68,18.67
  other vias: 6.3,20.41
N$4
  Top 0.152: 4.73,18.91 C8.1
  Top 0.203: U10.D23 6.45,19.8 6.13,19.8 5.24,18.91 4.73,18.91
N$5
  Top 0.102: U10.H23 6.56,21.16 6.45,21.05 5.64,21.05 C1.1
  Top 0.305: C1.1 4.61,21.32 arc-90 L1.2
N$6
  Top 0.305: L1.1 arc-90 3.59,21.32 C2.1 arc-90 1.64,22.51 A2.S1
N$7
  cutout Route2: 5.14,23.4 5.14,29.12 0.06,29.12 0.06,23.4
N$8
  Top 0.203: C3.2 X1.3 2.15,14.99 1.32,15.82 1.32,16.83 2.04,17.55 4.44,17.55 U10.B24
N$9
  Top 0.203: U10.A23 5.1,17.2 5.08,17.2 X1.1 5.58,16.69 C4.2
N$10  (via drill 0.2)
  Top 0.254: U4.23 9.08,49.08 v9.14,49.15 | v9.65,53.72 C18.1 | U4.13 10.03,45.87 | 10.03,45.87 v10.03,45.47 | U4.14 10.14,45.87 10.03,45.87
  Bottom 0.254: v9.65,53.72 9.14,53.21 v9.14,49.15 10.03,49.15 10.67,48.51 10.67,45.97 10.16,45.47 v10.03,45.47
N$11
  cutout Top: 6.86,21.84 6.86,20.07 2.29,20.07 2.29,21.84
N$12
  Top 0.203: R10.2 22.48,39.37 22.88,39.77 U7.4
N$13  (via drill 0.2, 0.3)
  Top 0.203: U6.5 6.99,29.97 v7.11,29.84 | C19.1 6.99,40.97
  Top 0.254: U4.12 9.53,45.97 9.53,42.04 | Q4.6 14.22,33.98 14.22,34.92 v14.1,35.05
  Top 0.305: 6.99,40.97 6.99,44.58 7.87,45.46 U4.8 | U9.1 12.38,34.99 v12.32,35.05
  Top 0.813: C19.1 7.06,41.86 7.75,42.55 9.02,42.55 9.53,42.04 v9.62,41.94 9.62,40.94 C17.1
  Route15 0.406: v12.32,35.05 v14.1,35.05
  Bottom 0.203: v7.11,29.84 7.11,32.57 7.64,33.11 7.64,33.3 11.05,36.7
  Bottom 0.813: v12.32,35.05 11.05,36.32 11.05,36.7 11.05,40.51 v9.62,41.94
N$14
  Top 0.203: U7.6 21.09,40.77 R15.1
N$15
  Top 0.152: D2.2 15.85,57.15 R1.1
N$17
  Top 0.152: R2.1 14.22,58.73 D2.4
N$18
  Top 0.254: R14.2 21.82,54.43 | 21.82,54.43 R11.1 | U2.7 20.95,53.56 21.82,54.43
N$19
  Top 0.152: D2.3 14.2,57.86 R3.1
N$20
  Top 0.203: U8.1 20.15,1.11 Q1.6
N$23
  Top 0.203: Q1.3 18.24,2.96 18.16,3.05
  Top 0.406: U3.VCC 3.68,7.34 3.68,5.59 8.26,1.02 14.86,1.02 16.89,3.05 18.16,3.05
N$25
  Top 0.203: U1.14 14.48,7.24 14.22,6.99 12.88,6.99 C7.1
N$26
  Top 0.203: U1.16 15.48,7.25 16.48,6.25 X4.1 17.96,5.71 C30.1
N$27
  Top 0.203: U1.15 14.98,7.24 14.99,7.24 14.22,6.48 13.97,6.48 13.99,6.45 X4.2 12.52,5.71 C31.1
N$32
  Top 0.254: U2.8 20.45,54.03 R4.2 20.88,54.36 R11.2
N$35
  cutout Route15: 5.14,23.4 5.14,29.12 0.06,29.12 0.06,23.4
N$38
  cutout Top: 0.06,23.4 0.06,29.12 2.84,29.12 5.14,29.12 5.14,28.23 4.11,28.23 4.11,26.71 5.14,26.7 5.14,23.4
N$39
  cutout Bottom: 5.14,23.4 5.14,29.12 0.06,29.12 0.06,23.4
N$44
  Top 0.254: L4.2 12.74,18.73 12.72,18.73 U10.B3
N$45
  Top 0.203: Q5.4 20.24,44.11 19.81,43.69 18.54,43.69 18.29,43.94 18.29,45.21 18.54,45.47 19.2,45.47 Q5.1
N$49
  Top 0.254: L4.1 12.74,15.54 L2.2
N$51
  Top 0.152: Q3.3 22.18,1.82 22.61,1.4 23.88,1.4 24.38,1.91 24.38,2.46 U8.6
N$52
  Top 0.152: Q3.6 23.82,3.56 25.15,3.56 25.53,3.17 U8.5
N$53
  Top 0.152: Q6.4 20.45,34.59
  Top 0.203: Q6.1 19.59,33.61 19.59,32.89 19.84,32.64 21.02,32.64 21.32,32.94 21.32,34.21 20.94,34.59 20.45,34.59
N$57
  Top 0.254: R13.2 R12.1 17.78,53.77 17.78,51.94 18.07,51.65 U2.12
N$58
  Top 0.254: U2.11 18.35,52.51 18.35,53.45 R4.1 20.12,55.22 R12.2
PCLKO
  Top 0.102: U10.AD16 8.89,25.5 8.89,29.06 8.89,29.72 | 8.89,29.72 8.89,34.42 11.43,36.96 11.43,45.73 U4.16 | TP18.P$1 8.89,29.72
PIR_OUT
  Top 0.152: U3.OUT 2.54,4.92 2.54,7.62 | U10.A20 7.87,18.83 7.87,12.95 2.54,7.62 | TP22.P$1 2.54,8.38 2.54,7.62
RTC_CS  (via drill 0.15, 0.2)
  Top 0.152: U1.12 12.81,8.52 11.56,9.78 TP6.P$1 11.56,12.15 8.72,14.99 v8.64,14.99
  Bottom 0.152: U10.B17 8.64,19.32 v8.64,14.99
  other vias: 8.55,19.41
SCK  (via drill 0.15, 0.2)
  Top 0.152: U1.7 v14.48,11.43 | TP3.P$1 15.37,13.59 v15.98,12.98 16.87,12.98 18.16,14.27 18.16,20.95 16.76,22.35 v13.34,22.35
  Bottom 0.152: v14.48,11.43 14.48,11.56 15.9,12.98 v15.98,12.98 | U10.M2 12.49,22.35 v13.34,22.35
  other vias: 12.3,22.16
SCL  (via drill 0.15, 0.2)
  Top 0.152: v11.94,26.29 15.62,26.29 | 15.62,26.29 16.36,26.29 20.95,21.7 20.95,11.81 | v21.08,4.06 22.18,2.96 Q3.1 | 20.95,11.81 20.95,8.13 19.94,7.11 19.94,6.1 v20.19,5.84 | v22.65,5.12 22.23,5.54 TP2.P$1 | R20.1 20.25,11.81 20.95,11.81 | Q2.4 15.62,30.3 15.62,26.29
  Bottom 0.152: v20.19,5.84 20.19,4.95 v21.08,4.06 22.14,5.12 v22.65,5.12 | U10.AC9 v11.94,26.29
  other vias: 10.55,24.91
SDA  (via drill 0.2)
  Top 0.152: v19.81,5.46 19.68,5.59 19.68,14.73 | 19.68,14.73 19.68,21.59 15.88,25.4 12.77,25.4 12.63,25.54 12.26,25.91 11.3,25.91 | TP1.P$1 23.24,4.95 v23.88,4.32 | U10.AD8 10.8,25.66 11.05,25.91 11.3,25.91 | R19.1 20.14,14.73 19.68,14.73 | Q2.1 13.87,31.59 13.72,31.75 13.46,31.75 12.95,31.24 12.95,30.23 11.3,28.57 11.3,25.91
  Top 0.203: Q3.4 23.24,1.85 v23.69,1.85
  Bottom 0.152: v19.81,5.46 19.81,3.56 21.97,1.4 23.24,1.4 v23.69,1.85 24,2.16 24,4.19 v23.88,4.32
SW  (via drill 0.2)
  Top 0.152: v16.76,23.11 16.64,22.99 12.88,22.99 U10.R1
  Bottom 0.152: v24,36.2 24,30.35 v16.76,23.11
  pour Top (isolate 0.203, no thermals): 22.1,38.86 22.1,35.94 26.92,35.94 26.92,37.59 22.35,37.59 22.35,38.86
SWDCLK  (via drill 0.15, 0.2)
  Top 0.152: J1.4 1.91,33.53 v1.4,33.02
  Route15 0.152: U10.AA24 6.37,24.41 6.73,24.77 6.73,29.7 3.79,32.64 1.78,32.64 v1.4,33.02
  other vias: 6.3,24.41
SWDIO  (via drill 0.15, 0.2)
  Top 0.152: v1.4,31.88 J1.2
  Route15 0.152: U10.AC24 6.35,24.96 6.35,29.72 3.94,32.13 1.65,32.13 v1.4,31.88
  other vias: 6.3,24.91
VBAT  (via drill 0.15, 0.2, 0.3)
  Top 0.152: U1.5 15.48,11.29 v15.62,11.43
  Top 0.203: Q6.6 19.63,34.67 19.43,34.67
  Top 0.254: U2.14 18.26,50.65 v17.53,49.91
  Top 0.305: v17.02,35.81 18.16,34.67 19.43,34.67
  Top 0.813: v17.53,49.91 16.26,48.64 16.26,36.58 v17.02,35.81
  Route15 0.152: v15.62,11.43 14.86,12.19
  Route15 0.203: U10.A10 11.17,18.03 12.19,18.03
  Route15 1.016: BT2.2 14.35,28.45 16.51,30.61 16.51,35.31 v17.02,35.81
  other vias: 10.3,18.91
  pour Route15 (no thermals): 12.06,30.1 15.11,30.1 15.11,1.14 12.06,1.14
VBAT_OK  (via drill 0.15, 0.2)
  Top 0.152: v17.91,51.18 17.94,51.15 U2.13
  Bottom 0.152: v17.91,51.18 17.91,48.01 15.24,45.34 15.24,32.64 16.13,31.75 16.13,30.86 15.75,30.48 15.75,25.53 13.38,23.16 U10.T2
  other vias: 12.3,23.16
VCC  (via drill 0.2, 0.3, 0.41)
  Top 0.152: D2.1 16.13,58.29 v14.99,58.29 | TP26.P$1 v0.76,13.59 | v25.78,54.48 25.73,54.43 R6.2 | J1.1 3.56,32 v3.56,31.5 | R20.2 v20.19,13.21 R19.2 | Q4.1 14.05,32.85 v13.97,32.77 | U10.W1
  Top 0.203: C13.1 6.38,25.72 6.66,25.44 6.76,25.44 U10.AD23 | 7.31,17.38 C16.1 | R7.2 17.81,7.05 R8.2 | U1.13 13.86,7.75 12.7,7.75 C23.1 | Q1.1 19.2,3.02 v19.65,3.02 20.24,3.02 C22.1 | Q1.4 17.56,2.12 R17.2 17.45,2.16 v16.89,2.16 | R5.2 21.08,5.28 v21.08,4.7 20.25,4.7 R16.2
  Top 0.254: 13.24,18.98 13.23,18.98 U10.B1 | U10.A22 7.3,18.29 | 7.31,17.38 7.3,17.39 7.3,18.29 | v6.86,18.29 7.3,18.29 | 12.7,7.75 12.07,7.12 v11.43,7.12 | R8.2 18.8,6.93 v18.8,6.22 | U10.AD14 v9.3,26.7 9.3,27.28 C14.1 | C13.1 5.79,26.46 v5.74,26.41
  Top 0.305: 13.24,18.98 13.24,18.73 13.5,18.48 | R18.2 13.46,35.42 C29.1 14.73,35.16 v14.73,34.8 | v10.54,30.48 10.48,30.54 U9.4 U9.5
  Top 0.406: 14.1,17.88 C20.1 | 14.1,17.88 13.5,18.48 | U10.Y2 12.55,24.16 U10.W1 12.97,24.08 C24.1 14.99,24.08 15.42,24.51 v15.49,24.51 | v16.13,17.02 14.96,17.02 14.72,17.26 14.71,17.26 14.1,17.88
  other vias: 20.19,37.72 21.08,36.45 20.83,37.21
  pour Top (isolate 0.203, no thermals): 20.7,38.73 21.59,38.73 21.59,35.94 19.68,35.94 19.68,38.23 20.7,38.23
  pour Route15 (rank 2): 0,60 27,60 27,0 0,0
VOC_SAMP_VSTOR  (via drill 0.2)
  Top 0.203: v20.95,48.39 20.95,48.62 U2.19
  Top 0.254: U2.3 22.2,51.17 23.69,51.17 23.73,51.21 v23.84,51.21
  Top 0.406: v20.95,48.39 20.95,47.7 C25.1
  Bottom 0.406: v20.95,48.39 23.78,51.21 v23.84,51.21
  pour Top (no thermals): 20.57,48.13 21.21,48.13 21.21,45.21 20.07,45.21 20.07,45.72 20.57,46.23
VREF_SAMP
  Top 0.406: U2.4 22.93,51.65 22.93,53.25 C10.1
VSEC  (via drill 0.2)
  Top 0.152: U10.A8 10.8,18.67 10.29,18.16 10.29,15.75 11.3,14.73 15.11,14.73 v17.53,17.14 | v19.05,24.26 19.05,31.79 BT1.+
  Top 0.254: U2.18 20.45,48.39 v20.19,48.13
  Bottom 0.152: v17.53,17.14 17.53,17.17 19.05,18.69 v19.05,24.26
  Bottom 0.813: v20.19,48.13 15.88,43.81 15.88,34.97 BT1.+
VSOL  (via drill 0.15, 0.2)
  Top 0.406: U2.2 24.5,50.65
  Bottom 0.152: U10.B9 11.05,18.91 11.05,18.41 11.3,18.16 12.57,18.16 13.34,18.92 v15.88,18.92 17.14,20.19 17.14,22.99 25.15,30.99 D1.+
  other vias: 10.55,19.41
  pour Top (no thermals): 24.26,53.51 24.26,44.16 27.02,44.16 27.02,53.51
VSW  (via drill 0.2, 0.41)
  Top 0.152: v18.8,44.16 19.21,44.58 Q5.3
  Top 0.203: Q6.3 20.83,33.33 v20.83,33.15
  Top 0.406: R15.2 18.53,41.24 C27.1
  Bottom 0.61: v18.8,44.16 20.8,42.16
  Bottom 0.813: 20.8,42.16 v20.7,42.16 18.03,39.5 18.03,37.72 19.68,36.07 20.18,36.07 20.83,35.42 v20.83,33.15
  pour Top (isolate 0.203, no thermals): 22.1,39.88 22.1,41.4 19.81,41.4 19.81,42.8 26.92,42.8 26.92,40.89 22.35,40.89 22.35,39.88
WDI
  Top 0.152: U1.2 17.53,9.02 | 17.53,9.02 17.83,9.02 R8.1 | 17.53,9.02 17.53,10.74 14.55,13.72 13.21,13.72 | U10.A12 9.91,18.8 9.91,15.62 11.81,13.72 13.21,13.72 | TP16.P$1 13.21,13.72
XL1
  Top 0.102: U10.D2 12.56,20.16 12.66,20.25 13.34,20.25 14.1,19.49 14.83,19.49 X3.A
  Top 0.203: X3.A 15.61,20.12 15.69,20.19 C6.2
XL2
  Top 0.102: U10.F2 12.55,20.66 12.66,20.55 14.08,20.55 X3.B
  Top 0.203: C5.2 14.44,20.58 X3.B

### Text on the board
bPlace: SECONDARY
tNames: RESET | SOLAR | Permacam / Neal Jackson / 10/19 | VCC | GND | SOLAR